# EAGLE design Spectrometer (EAGLE 9.6.2)
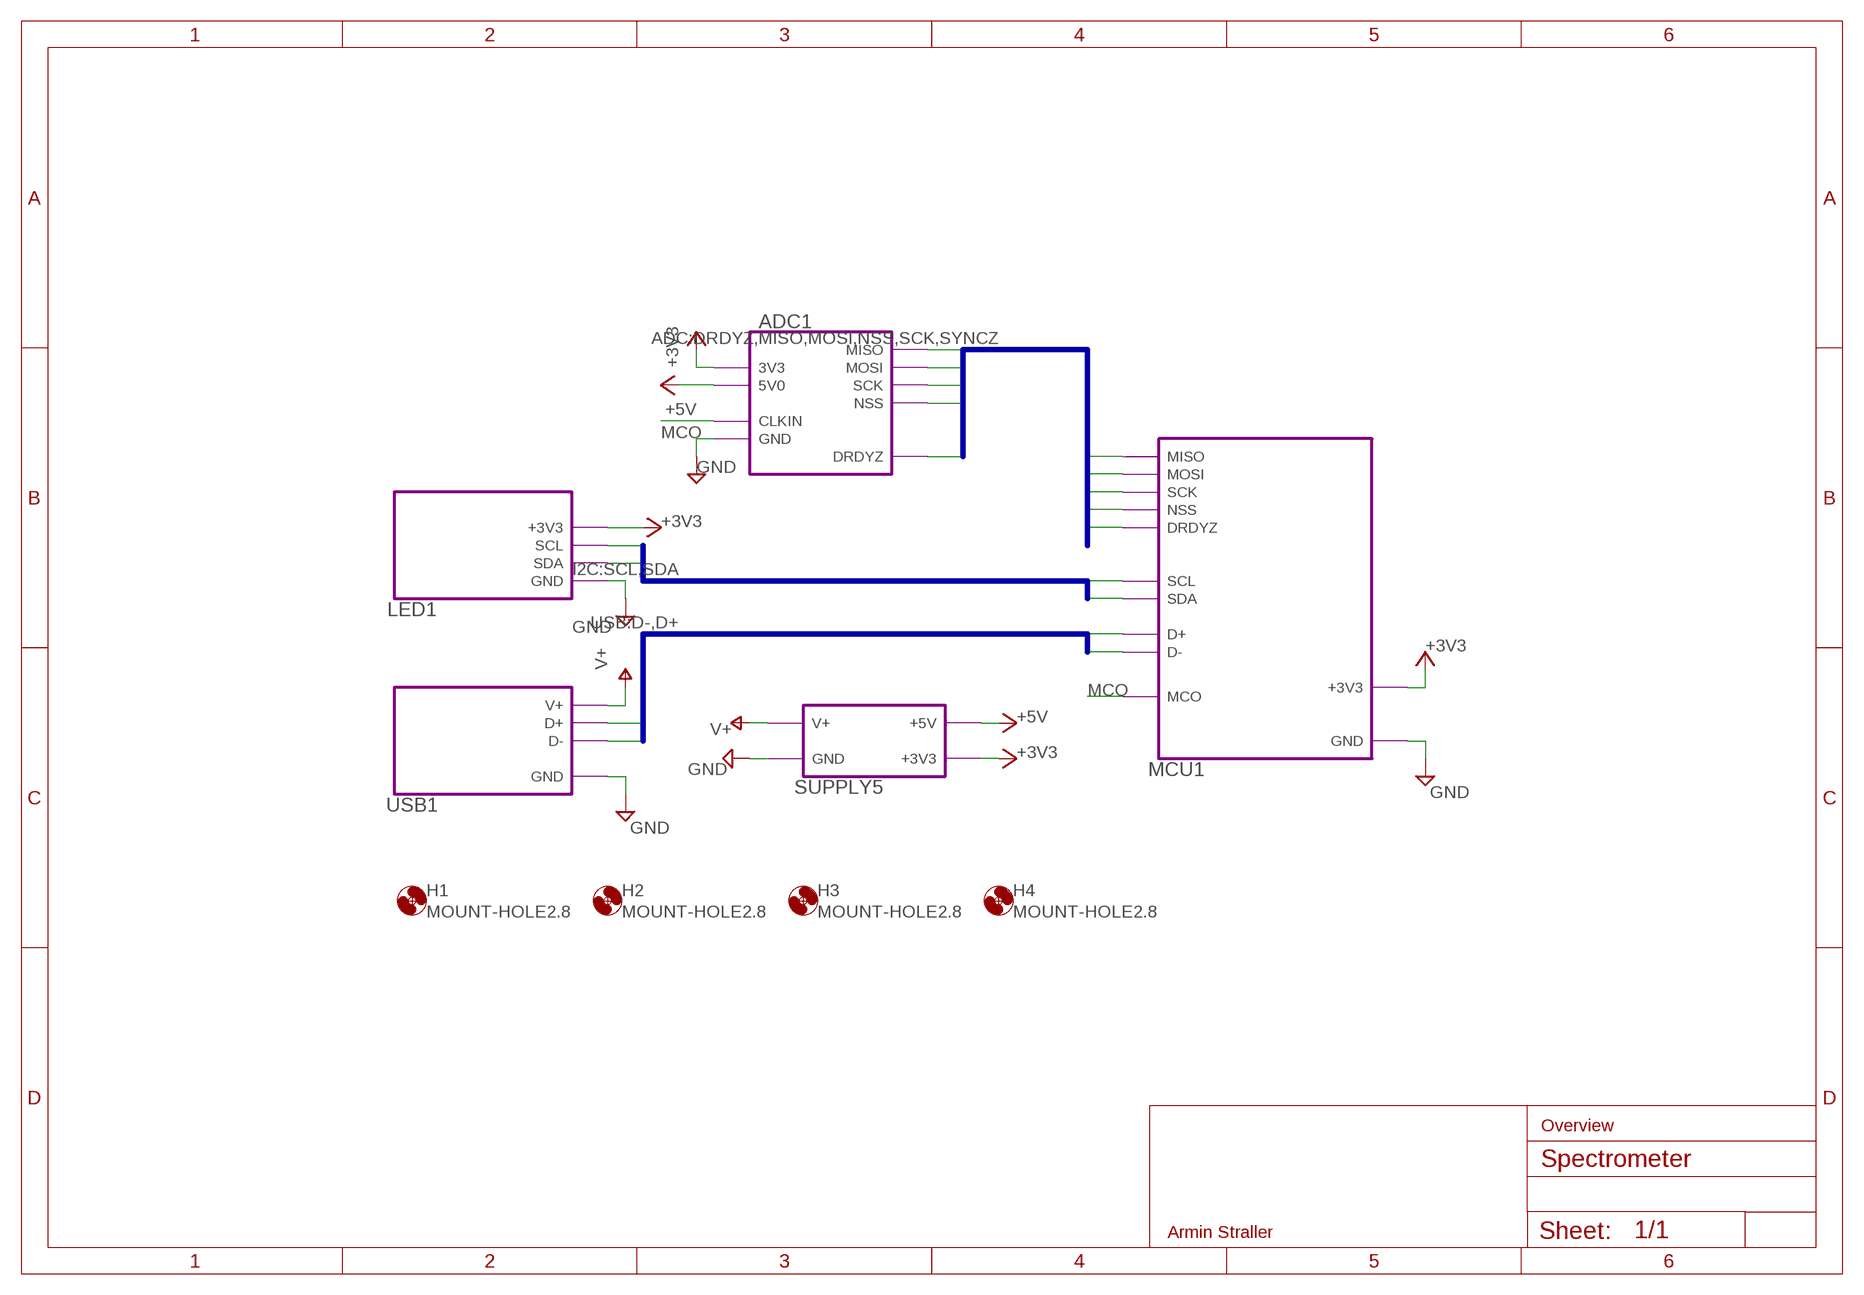
[diagram p0: schematic, sheet 1]

## Parts
H1  MOUNT-HOLE2.8  [2,8]
H2  MOUNT-HOLE2.8  [2,8]
H3  MOUNT-HOLE2.8  [2,8]
H4  MOUNT-HOLE2.8  [2,8]

## Module instances
USB1 = USB_CONNECTOR (part numbers offset by 400)
MCU1 = MICROCONTROLLER (part numbers offset by 300)
ADC1 = ANALOG_FRONTEND (part numbers offset by 200)
LED1 = LED_DRIVER (part numbers offset by 100)
SUPPLY5 = POWER_SUPPLY (part numbers offset by 500)

## Nets
+3V3: port ADC1.3V3 MCU1.+3V3 LED1.+3V3 SUPPLY5.+3V3
+5V: port ADC1.5V0 SUPPLY5.+5V
D+: port USB1.D+ MCU1.D+
D-: port USB1.D- MCU1.D-
DRDYZ: port ADC1.DRDYZ MCU1.DRDYZ
GND: port ADC1.GND USB1.GND MCU1.GND LED1.GND SUPPLY5.GND
MCO: port MCU1.MCO ADC1.CLKIN
MISO: port ADC1.MISO MCU1.MISO
MOSI: port ADC1.MOSI MCU1.MOSI
NSS: port ADC1.NSS MCU1.NSS
SCK: port ADC1.SCK MCU1.SCK
SCL: port MCU1.SCL LED1.SCL
SDA: port MCU1.SDA LED1.SDA
V+: port SUPPLY5.V+ USB1.V+

## Buses
ADC:DRDYZ,MISO,MOSI,NSS,SCK,SYNCZ
I2C:SCL,SDA
USB:D-,D+

## Notes on the sheet
- Overview
- Armin Straller

## Library data of the parts
H1-H4 = holes:MOUNT-HOLE: MOUNTING HOLE with drill center marker

## Module ANALOG_FRONTEND
Ports: 3V3(io) 5V0(io) GND(io) MISO(io) MOSI(io) SCK(io) NSS(io) DRDYZ(io) CLKIN(io)
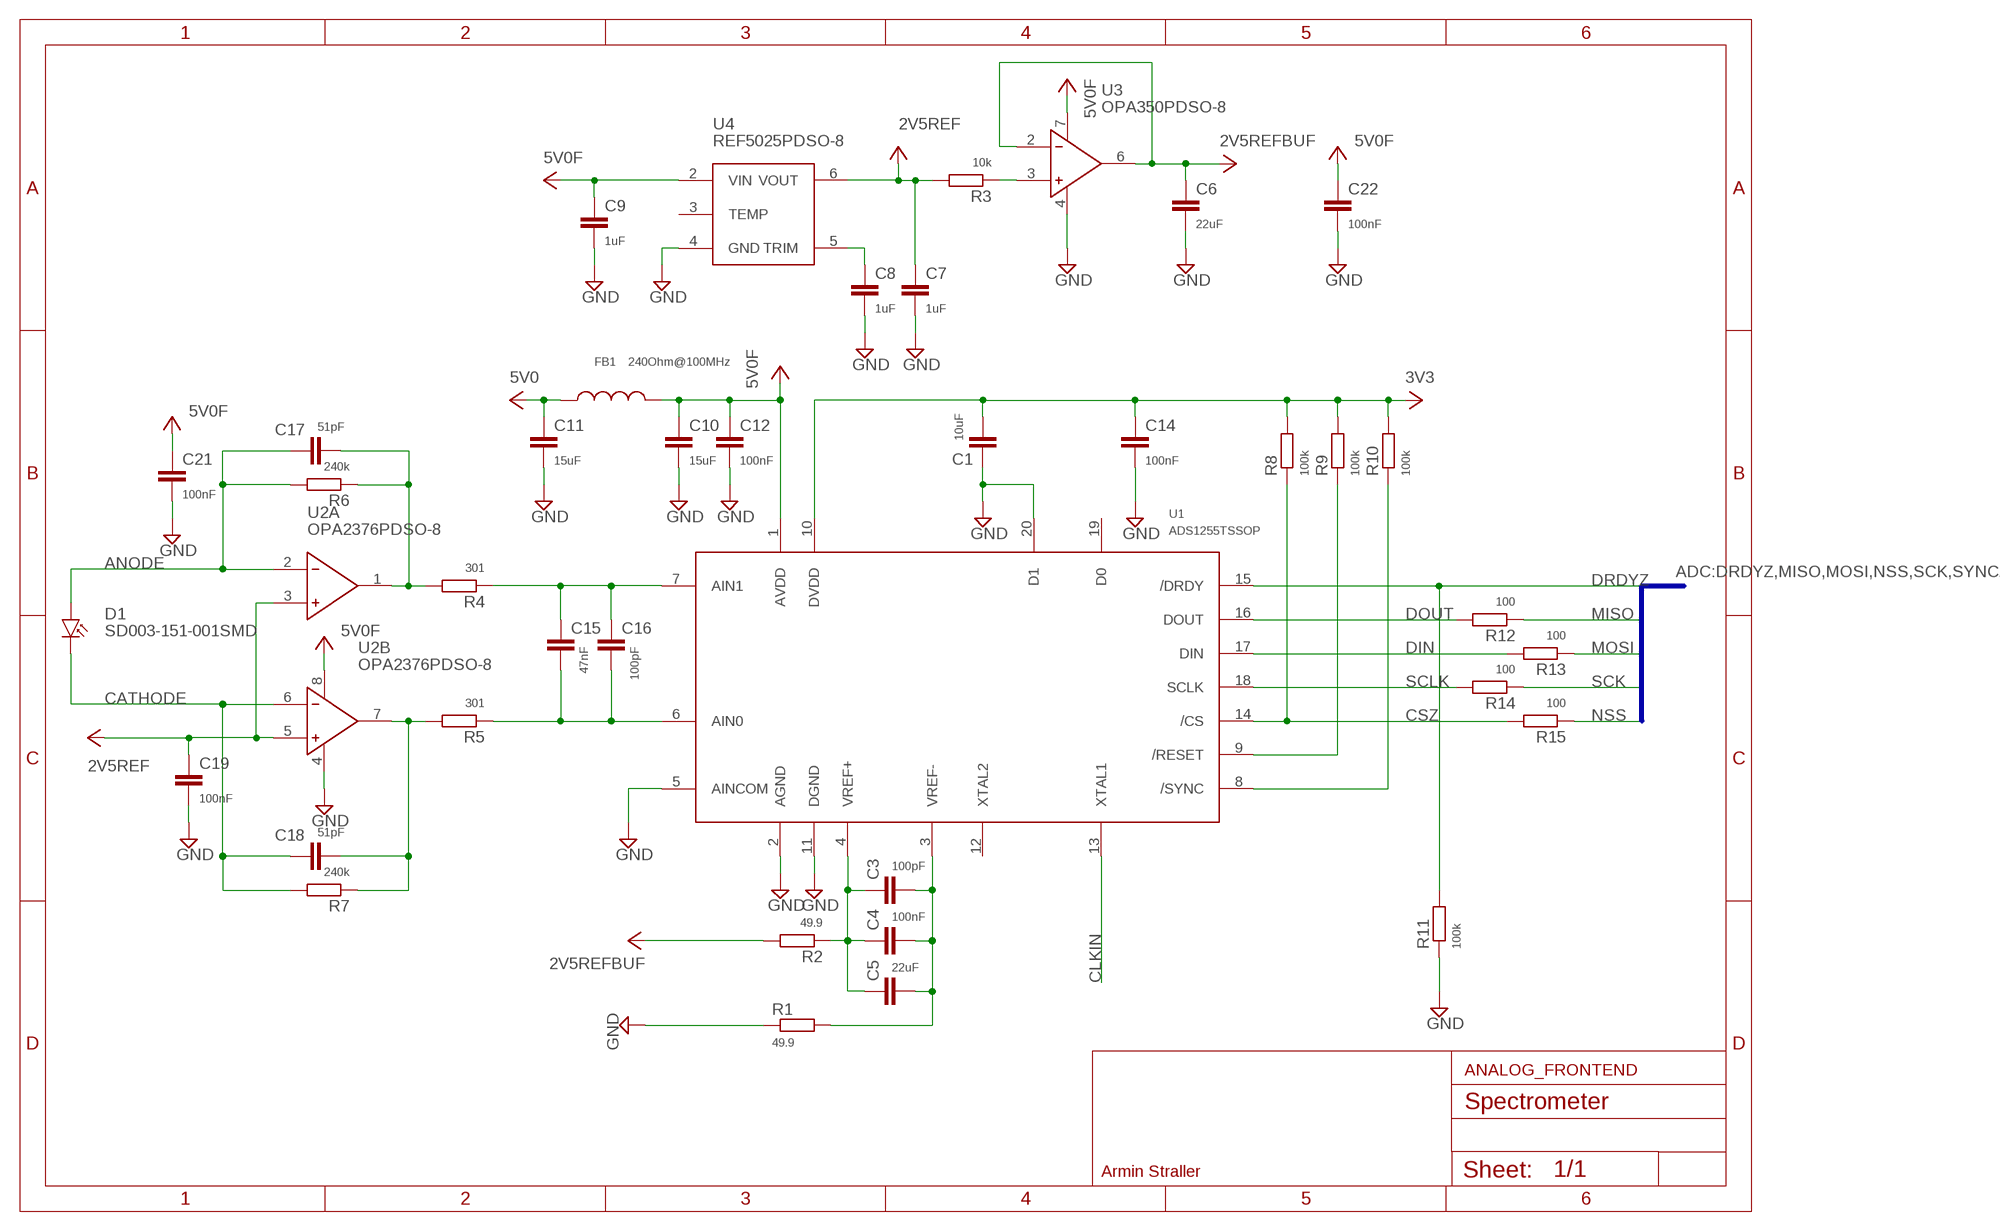
[diagram p1: schematic, module ANALOG_FRONTEND, sheet 1]

### Parts
C1  10uF  C-EUC0805  [C0805]
C3  100pF  C-EUC0402K  [C0402K]
C4  100nF  C-EUC0402K  [C0402K]
C5  22uF  C-EUC0805  [C0805]
C6  22uF  C-EUC0805  [C0805]
C7  1uF  C-EUC0402K  [C0402K]
C8  1uF  C-EUC0402K  [C0402K]
C9  1uF  C-EUC0402K  [C0402K]
C10  15uF  C-EUC0603K  [C0603K]
C11  15uF  C-EUC0603K  [C0603K]
C12  100nF  C-EUC0402K  [C0402K]
C14  100nF  C-EUC0402K  [C0402K]
C15  47nF  C-EUC0402K  [C0402K]
C16  100pF  C-EUC0402K  [C0402K]
C17  51pF  C-EUC0402K  [C0402K]
C18  51pF  C-EUC0402K  [C0402K]
C19  100nF  C-EUC0402K  [C0402K]
C21  100nF  C-EUC0402K  [C0402K]
C22  100nF  C-EUC0402K  [C0402K]
D1  SD003-151-001SMD  [LEDC3316X110]
FB1  240Ohm@100MHz  WE-CBF_0603_742792631_WB_HS  [WE-CBF_0603(W=2.2)]
R1  49.9  R-EU_R0402  [R0402]
R2  49.9  R-EU_R0402  [R0402]
R3  10k  R-EU_R0402  [R0402]
R4  301  R-EU_R0402  [R0402]
R5  301  R-EU_R0402  [R0402]
R6  240k  R-EU_R0402  [R0402]
R7  240k  R-EU_R0402  [R0402]
R8  100k  R-EU_R0402  [R0402]
R9  100k  R-EU_R0402  [R0402]
R10  100k  R-EU_R0402  [R0402]
R11  100k  R-EU_R0402  [R0402]
R12  100  R-EU_R0402  [R0402]
R13  100  R-EU_R0402  [R0402]
R14  100  R-EU_R0402  [R0402]
R15  100  R-EU_R0402  [R0402]
U1  ADS1255TSSOP  [SOP65P780X200-20]
U2  OPA2376PDSO-8  [SOP65P490X110-8]
U3  OPA350PDSO-8  [SOP65P490X110-8]
U4  REF5025PDSO-8  [SOP65P490X110-8]

### Nets
2V5REF: C7.1 C19.1 R3.2 U2.3(A:IN2) U2.5(B:IN2) U4.6(VOUT)
2V5REFBUF: C6.2 R2.2 U3.2(IN1) U3.6(OUT1)
3V3: C1.2 C14.1 R8.2 R9.2 R10.2 U1.10(DVDD)
5V0: C11.2 FB1.1
5V0F: C9.1 C10.2 C12.1 C21.1 C22.1 FB1.2 U1.1(AVDD) U2.8(B:VDD) U3.7(VDD) U4.2(VIN)
ANODE: C17.1 D1.2(ANODE) R6.2 U2.2(A:IN1)
CATHODE: C18.1 D1.1(CATHODE) R7.2 U2.6(B:IN1)
CLKIN: U1.13(XTAL1)
CSZ: R8.1 R15.2 U1.14(/CS)
DIN: R13.2 U1.17(DIN)
DOUT: R12.2 U1.16(DOUT)
DRDYZ: R11.2 U1.15(/DRDY)
GND: C1.1 C6.1 C7.2 C8.2 C9.2 C10.1 C11.1 C12.2 C14.2 C19.2 C21.2 C22.2 R1.1 R11.1 U1.2(AGND) U1.5(AINCOM) U1.11(DGND) U1.20(D1) U2.4(B:GND) U3.4(GND) U4.4(GND)
MISO: R12.1
MOSI: R13.1
N$3: C3.2 C4.2 C5.2 R1.2 U1.3(VREF-)
N$4: C3.1 C4.1 C5.1 R2.1 U1.4(VREF+)
N$5: R3.1 U3.3(IN2)
N$6: C8.1 U4.5(TRIM)
N$7: C17.2 R4.2 R6.1 U2.1(A:OUT1)
N$8: C18.2 R5.2 R7.1 U2.7(B:OUT1)
N$9: C15.2 C16.2 R5.1 U1.6(AIN0)
N$10: C15.1 C16.1 R4.1 U1.7(AIN1)
N$11: R9.1 U1.9(/RESET)
NSS: R15.1
SCK: R14.1
SCLK: R14.2 U1.18(SCLK)
SYNCZ: R10.1 U1.8(/SYNC)
Unconnected: U1.12(XTAL2) U1.19(D0) U4.3(TEMP)

### Buses
ADC:DRDYZ,MISO,MOSI,NSS,SCK,SYNCZ

### Notes on the sheet
- Armin Straller

### Library data of the parts
C1 C3-C12 C14-C19 C21 C22 = rcl:C-EU: CAPACITOR, European symbol; SPICEPREFIX: C
D1 = spectrometer:SD003-151-001: Surface-Mount InGaAs Photodetector
FB1 = Wurth_EMC Components_WE-CBF:WE-CBF_0603: WE-CBF SMD EMI Suppression Ferrite Bead Characteristics Reliable Ni-Sn electrodes High rated current up to 6 A Operating temperature: –55 ºC to +125 ºC Applications Perfect as data lined filter and for uncoupling of distribution voltage Package name and Variant abbreviation: Package: Wide Band /High Speed: W=Width= 2.2 High Current: W=Width= 2.6 Variant abbreviation: WB = Wide Band HS=High Speed HC=High Current <https://katalog.we-online.de/media/images/v2/o14753v209%20Family_WE-CBF.jpg> Details see: http://katalog.we-online.de/en/pbs/WE-CBF Updated by Ella Wu 2019-01-02 2019 (C) Wurth Elektronik; DATASHEET-URL: https://www.we-online.com/catalog/datasheet/742792631.pdf; IR1: 200mA; IR2: 1800mA; MOUNT: SMT; PART-NUMBER: 742792631; RDC-MAX: 0.4Ohm; TYPE: Wide Band; Z: 235Ohm@1GMHz; ZMAX: 340Ohm
R1-R15 = rcl:R-EU_: RESISTOR, European symbol; SPICEPREFIX: R
U1 = spectrometer:ADS1255
U2 = spectrometer:OPA2376
U3 = spectrometer:OPA350
U4 = spectrometer:REF5025

## Module USB_CONNECTOR
Ports: GND(io) D+(io) D-(io) V+(io)
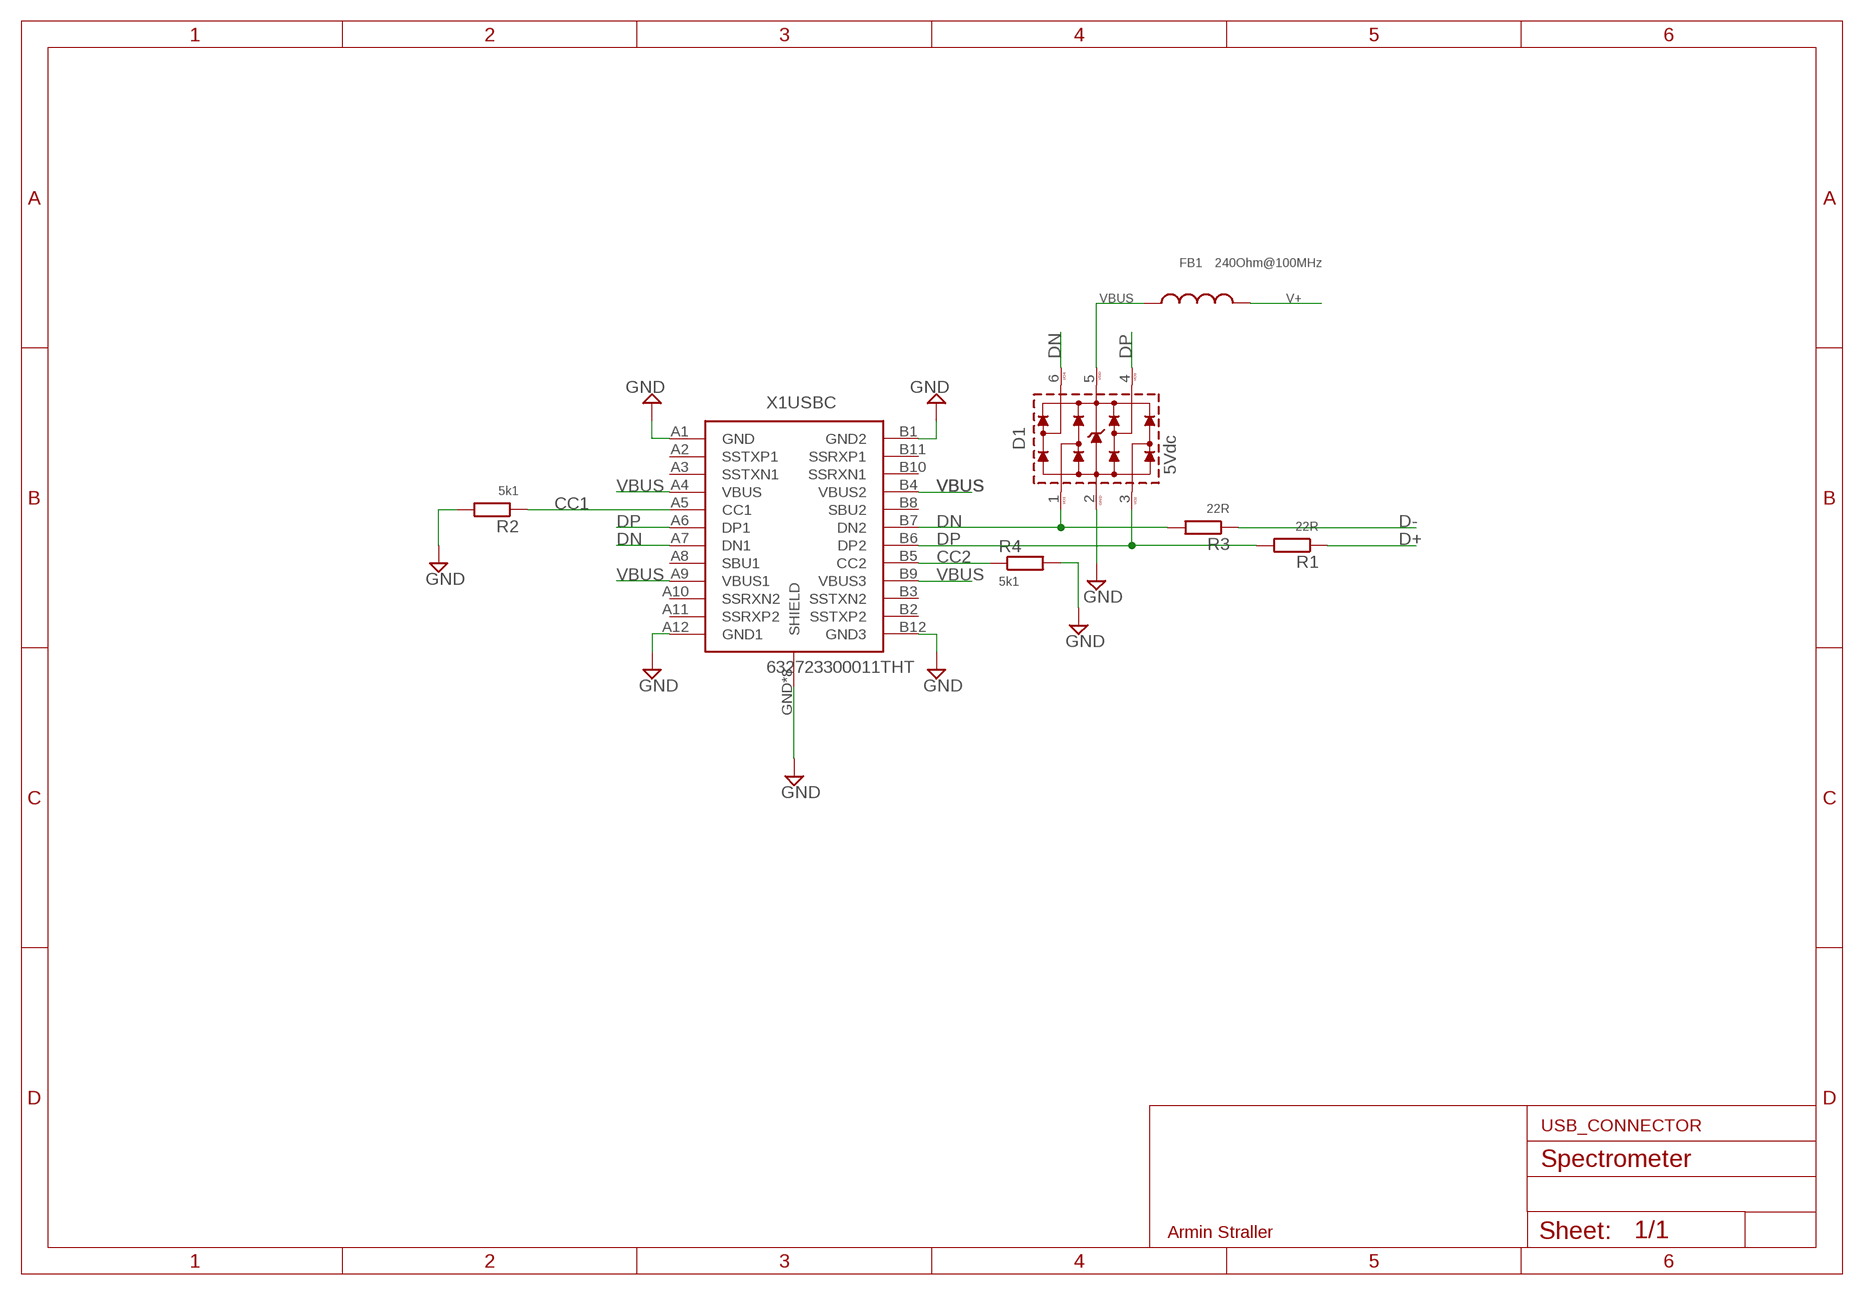
[diagram p2: schematic, module USB_CONNECTOR, sheet 1]

### Parts
D1  5Vdc  WE-TVS-HS_SOT23-6L_824001  [WE-TVS_SOT23-6L]
FB1  240Ohm@100MHz  WE-CBF_0603_742792631_WB_HS  [WE-CBF_0603(W=2.2)]
R1  22R  R-EU_R0402  [R0402]
R2  5k1  R-EU_R0402  [R0402]
R3  22R  R-EU_R0402  [R0402]
R4  5k1  R-EU_R0402  [R0402]
X1  632723300011THT  [USBC_HORZONTAL_WE]

### Nets
CC1: R2.1 X1.A5(USBC:CC1)
CC2: R4.1 X1.B5(USBC:CC2)
D+: R1.1
D-: R3.1
DN: D1.1 D1.6 R3.2 X1.A7(USBC:DN1) X1.B7(USBC:DN2)
DP: D1.3 D1.4 R1.2 X1.A6(USBC:DP1) X1.B6(USBC:DP2)
GND: D1.2(GND) R2.2 R4.2 X1.A1(USBC:GND) X1.A12(USBC:GND1) X1.B1(USBC:GND2) X1.B12(USBC:GND3) X1.GND1(SHIELD) X1.GND(SHIELD) X1.Z1(SHIELD) X1.Z2(SHIELD) X1.Z3(SHIELD) X1.Z4(SHIELD) X1.Z5(SHIELD) X1.Z6(SHIELD)
V+: FB1.2
VBUS: D1.5(VDD) FB1.1 X1.A4(USBC:VBUS) X1.A9(USBC:VBUS1) X1.B4(USBC:VBUS2) X1.B9(USBC:VBUS3)
Unconnected: X1.A2(USBC:SSTXP1) X1.A3(USBC:SSTXN1) X1.A8(USBC:SBU1) X1.A10(USBC:SSRXN2) X1.A11(USBC:SSRXP2) X1.B2(USBC:SSTXP2) X1.B3(USBC:SSTXN2) X1.B8(USBC:SBU2) X1.B10(USBC:SSRXN1) X1.B11(USBC:SSRXP1)

### Notes on the sheet
- Armin Straller

### Library data of the parts
D1 = Wurth_EMC Components_WE-TVS:WE-TVS-HS_SOT23-6L_824001: WE-TVS TVS Diode – High Speed Series Characteristics Low clamping voltage Sturdy design Very low capacitance Flow Thru Design for a simple layout Rail to Rail protection Epoxy flame resistant UL94-V0 RoHS, REACH and free of halogens Applications Very fast data lines USB 2.0 Ethernet PoE VGA Sim Cards Keypads HS = High Speed <https://katalog.we-online.com/media/images/v2/o14883v209%20Family_WE-TVS_HIGHSPEED.> Details see: https://katalog.we-online.com/en/pbs/WE-TVS-HS Updated by Ella Wu 2019-07-12 2019 (C) Wurth Elektronik; C-CH: 1pF; CHANNELS: 4+1; DATASHEET-URL: https://www.we-online.com/catalog/datasheet/824001.pdf; IPEAK: 5A; MOUNT: SMT; PART-NUMBER: 824001; VBR: 6.2V
FB1 = Wurth_EMC Components_WE-CBF:WE-CBF_0603: WE-CBF SMD EMI Suppression Ferrite Bead Characteristics Reliable Ni-Sn electrodes High rated current up to 6 A Operating temperature: –55 ºC to +125 ºC Applications Perfect as data lined filter and for uncoupling of distribution voltage Package name and Variant abbreviation: Package: Wide Band /High Speed: W=Width= 2.2 High Current: W=Width= 2.6 Variant abbreviation: WB = Wide Band HS=High Speed HC=High Current <https://katalog.we-online.de/media/images/v2/o14753v209%20Family_WE-CBF.jpg> Details see: http://katalog.we-online.de/en/pbs/WE-CBF Updated by Ella Wu 2019-01-02 2019 (C) Wurth Elektronik; DATASHEET-URL: https://www.we-online.com/catalog/datasheet/742792631.pdf; IR1: 200mA; IR2: 1800mA; MOUNT: SMT; PART-NUMBER: 742792631; RDC-MAX: 0.4Ohm; TYPE: Wide Band; Z: 235Ohm@1GMHz; ZMAX: 340Ohm
R1-R4 = rcl:R-EU_: RESISTOR, European symbol; SPICEPREFIX: R
X1 = spectrometer:632723300011

## Module MICROCONTROLLER
Ports: MISO(io) MOSI(io) SCK(io) NSS(io) DRDYZ(io) SCL(io) SDA(io) D+(io) D-(io) GND(io) +3V3(io) MCO(io)
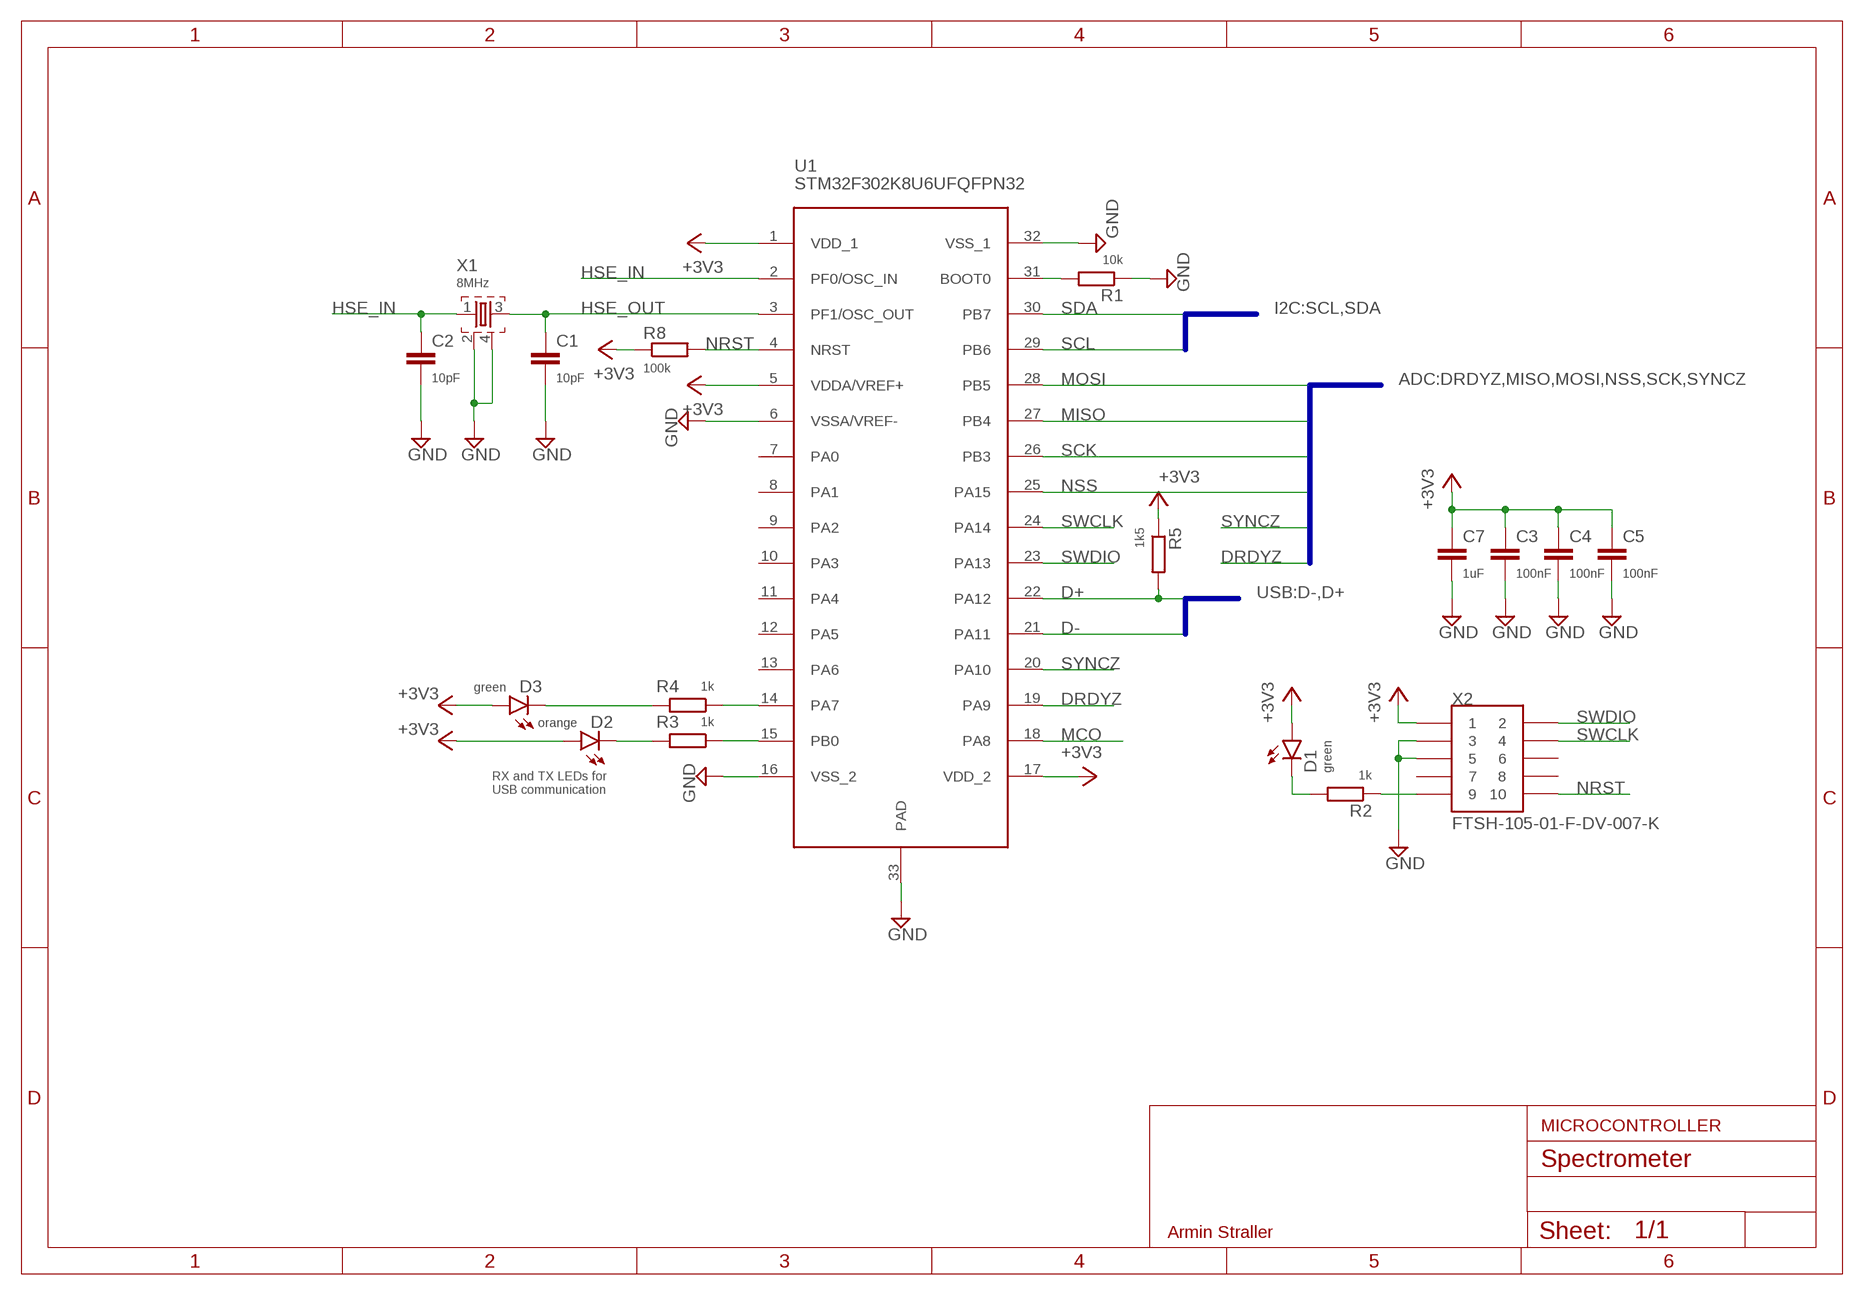
[diagram p3: schematic, module MICROCONTROLLER, sheet 1]

### Parts
C1  10pF  C-EUC0402K  [C0402K]
C2  10pF  C-EUC0402K  [C0402K]
C3  100nF  C-EUC0402K  [C0402K]
C4  100nF  C-EUC0402K  [C0402K]
C5  100nF  C-EUC0402K  [C0402K]
C7  1uF  C-EUC0402K  [C0402K]
D1  green  LEDCHIP-LED0603  [CHIP-LED0603]
D2  orange  LEDCHIP-LED0603  [CHIP-LED0603]
D3  green  LEDCHIP-LED0603  [CHIP-LED0603]
R1  10k  R-EU_R0402  [R0402]
R2  1k  R-EU_R0402  [R0402]
R3  1k  R-EU_R0402  [R0402]
R4  1k  R-EU_R0402  [R0402]
R5  1k5  R-EU_R0402  [R0402]
R8  100k  R-EU_R0402  [R0402]
U1  STM32F302K8U6UFQFPN32  [QFN50P500X500X60-33T350]
X1  8MHz  CRYSTALS-GND-LID-CFPX-218  [2.6X2.1-4-PAD]
X2  CORTEX-MDEBUG-10P  [CORTEX-M-CON-10P]

### Nets
+3V3: C3.1 C4.1 C5.1 C7.1 D1.A D2.A D3.A R5.1 R8.1 U1.1(VDD_1) U1.5(VDDA/VREF+) U1.17(VDD_2) X2.P$1
D+: R5.2 U1.22(PA12)
D-: U1.21(PA11)
DRDYZ: U1.19(PA9)
GND: C1.2 C2.2 C3.2 C4.2 C5.2 C7.2 R1.1 U1.6(VSSA/VREF-) U1.16(VSS_2) U1.32(VSS_1) U1.33(PAD) X1.2 X1.4 X2.P$3 X2.P$5
HSE_IN: C2.1 U1.2(PF0/OSC_IN) X1.1
HSE_OUT: C1.1 U1.3(PF1/OSC_OUT) X1.3
MCO: U1.18(PA8)
MISO: U1.27(PB4)
MOSI: U1.28(PB5)
N$1: R4.1 U1.14(PA7)
N$2: R1.2 U1.31(BOOT0)
N$3: R2.1 X2.P$9
N$4: D1.C R2.2
N$5: R3.1 U1.15(PB0)
N$6: D3.C R4.2
N$7: D2.C R3.2
NRST: R8.2 U1.4(NRST) X2.P$10
NSS: U1.25(PA15)
SCK: U1.26(PB3)
SCL: U1.29(PB6)
SDA: U1.30(PB7)
SWCLK: U1.24(PA14) X2.P$4
SWDIO: U1.23(PA13) X2.P$2
SYNCZ: U1.20(PA10)
Unconnected: U1.7(PA0) U1.8(PA1) U1.9(PA2) U1.10(PA3) U1.11(PA4) U1.12(PA5) U1.13(PA6) X2.P$6 X2.P$7 X2.P$8

### Buses
I2C:SCL,SDA
ADC:DRDYZ,MISO,MOSI,NSS,SCK,SYNCZ
USB:D-,D+

### Notes on the sheet
- RX and TX LEDs for 
  USB communication
- Armin Straller

### Library data of the parts
C1-C5 C7 = rcl:C-EU: CAPACITOR, European symbol; SPICEPREFIX: C
D1-D3 = led:LED: LED OSRAM: - CHIPLED LG R971, LG N971, LY N971, LG Q971, LY Q971, LO R971, LY R971 LH N974, LH R974 LS Q976, LO Q976, LY Q976 LO Q996 - Hyper CHIPLED LW Q18S LB Q993, LB Q99A, LB R99A - SideLED LS A670, LO A670, LY A670, LG A670, LP A670 LB A673, LV A673, LT A673, LW A673 LH A674 LY A675 LS A676, LA A676, LO A676, LY A676, LW A676 LS A679, LY A679, LG A679 - Hyper Micro SIDELED® LS Y876, LA Y876, LO Y876, LY Y876 LT Y87S - SmartLED LW L88C, LW L88S LB L89C, LB L89S, LG L890 LS L89K, LO L89K, LY L89K LS L896, LA L896, LO L896, LY L896 - TOPLED LS T670, LO T670, LY T670, LG T670, LP T670 LSG T670, LSP T670, LSY T670, LOP T670, LYG T670 LG T671, LOG T671, LSG T671 LB T673, LV T673, LT T673, LW T673 LH T674 LS T676, LA T676, LO T676, LY T676, LB T676, LH T676, LSB T676, LW T676 LB T67C, LV T67C, LT T67C, LS T67K, LO T67K, LY T67K, LW E67C LS E67B, LA E67B, LO E67B, LY E67B, LB E67C, LV E67C, LT E67C LW T67C LS T679, LY T679, LG T679 LS T770, LO T770, LY T770, LG T770, LP T770 LB T773, LV T773, LT T773, LW T773 LH T774 LS E675, LA E675, LY E675, LS T675 LS T776, LA T776, LO T776, LY T776, LB T776 LHGB T686 LT T68C, LB T68C - Hyper Mini TOPLED® LB M676 - Mini TOPLED Santana® LG M470 LS M47K, LO M47K, LY M47K Source: http://www.osram.convergy.de LUXEON: - LUMILED® LXK2-PW12-R00, LXK2-PW12-S00, LXK2-PW14-U00, LXK2-PW14-V00 LXK2-PM12-R00, LXK2-PM12-S00, LXK2-PM14-U00 LXK2-PE12-Q00, LXK2-PE12-R00, LXK2-PE12-S00, LXK2-PE14-T00, LXK2-PE14-U00 LXK2-PB12-K00, LXK2-PB12-L00, LXK2-PB12-M00, LXK2-PB14-N00, LXK2-PB14-P00, LXK2-PB14-Q00 LXK2-PR12-L00, LXK2-PR12-M00, LXK2-PR14-Q00, LXK2-PR14-R00 LXK2-PD12-Q00, LXK2-PD12-R00, LXK2-PD12-S00 LXK2-PH12-R00, LXK2-PH12-S00 LXK2-PL12-P00, LXK2-PL12-Q00, LXK2-PL12-R00 Source: www.luxeon.com KINGBRIGHT: KA-3528ASYC Source: www.kingbright.com
R1-R5 R8 = rcl:R-EU_: RESISTOR, European symbol; SPICEPREFIX: R
U1 = spectrometer:STM32F302K8U6
X1 = IQD-Frequency-Products:CRYSTALS-GND-LID: CRYSTALS WITH CAN GROUNDED
X2 = spectrometer:CORTEX-MDEBUG-10P

## Module LED_DRIVER
Ports: GND(io) +3V3(io) SCL(io) SDA(io)
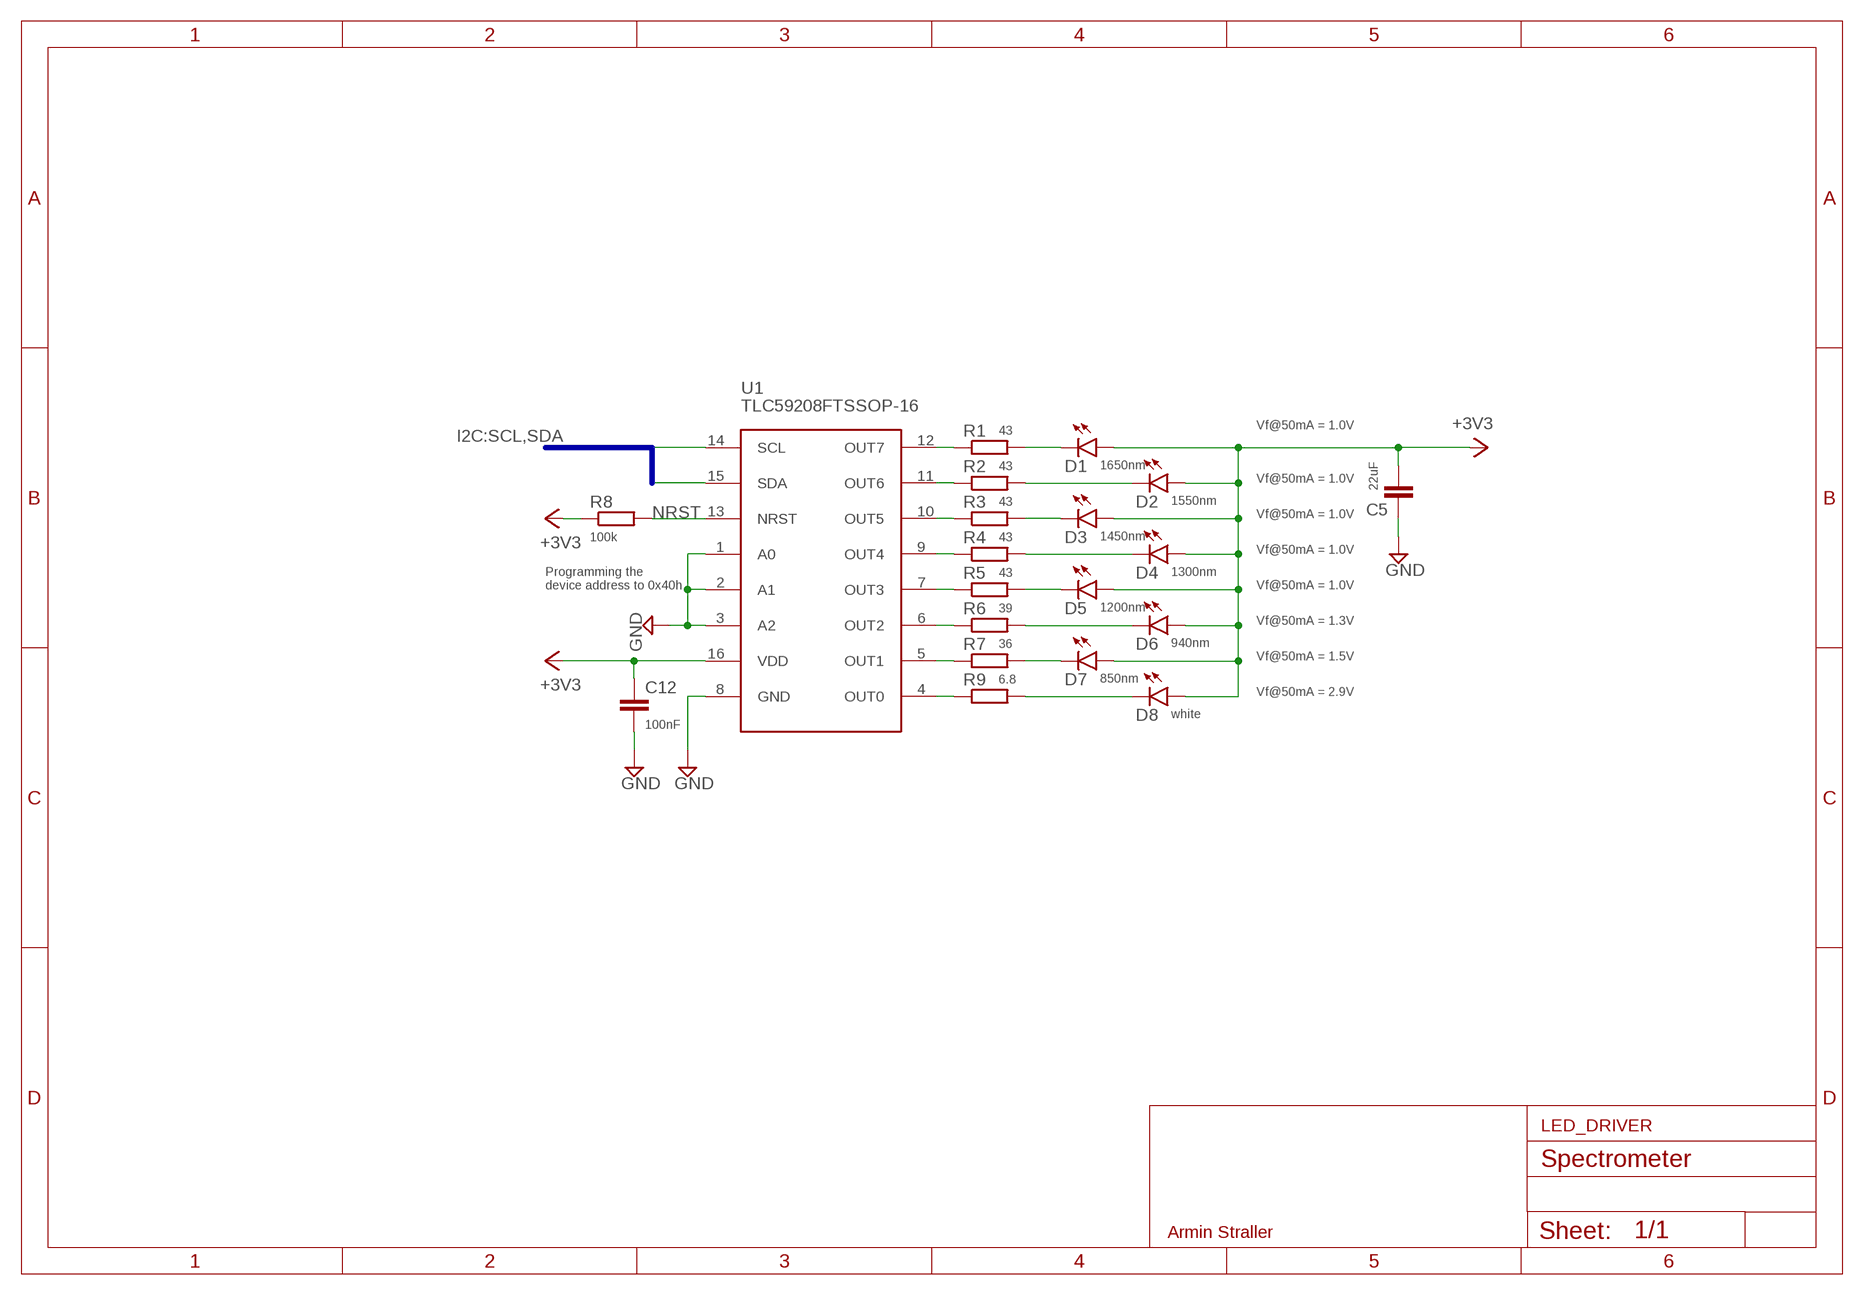
[diagram p4: schematic, module LED_DRIVER, sheet 1]

### Parts
C5  22uF  C-EUC0805  [C0805]
C12  100nF  C-EUC0402K  [C0402K]
D1  1650nm  LEDCHIPLED_1206  [CHIPLED_1206]
D2  1550nm  LEDCHIPLED_1206  [CHIPLED_1206]
D3  1450nm  LEDCHIPLED_1206  [CHIPLED_1206]
D4  1300nm  LEDCHIPLED_1206  [CHIPLED_1206]
D5  1200nm  LEDCHIPLED_1206  [CHIPLED_1206]
D6  940nm  LEDCHIPLED_1206  [CHIPLED_1206]
D7  850nm  LEDCHIPLED_1206  [CHIPLED_1206]
D8  white  LEDCHIPLED_1206  [CHIPLED_1206]
R1  43  R-EU_R0603  [R0603]
R2  43  R-EU_R0603  [R0603]
R3  43  R-EU_R0603  [R0603]
R4  43  R-EU_R0603  [R0603]
R5  43  R-EU_R0603  [R0603]
R6  39  R-EU_R0603  [R0603]
R7  36  R-EU_R0603  [R0603]
R8  100k  R-EU_R0402  [R0402]
R9  6.8  R-EU_R0603  [R0603]
U1  TLC59208FTSSOP-16  [SOP65P640X120-16]

### Nets
+3V3: C5.2 C12.1 D1.A D2.A D3.A D4.A D5.A D6.A D7.A D8.A R8.1 U1.16(VDD)
GND: C5.1 C12.2 U1.1(A0) U1.2(A1) U1.3(A2) U1.8(GND)
N$1: R1.1 U1.12(OUT7)
N$2: R2.1 U1.11(OUT6)
N$3: R3.1 U1.10(OUT5)
N$4: R4.1 U1.9(OUT4)
N$5: R5.1 U1.7(OUT3)
N$6: R6.1 U1.6(OUT2)
N$7: R7.1 U1.5(OUT1)
N$8: R9.1 U1.4(OUT0)
N$9: D8.C R9.2
N$10: D7.C R7.2
N$11: D6.C R6.2
N$12: D5.C R5.2
N$13: D4.C R4.2
N$14: D3.C R3.2
N$15: D2.C R2.2
N$16: D1.C R1.2
NRST: R8.2 U1.13(NRST)
SCL: U1.14(SCL)
SDA: U1.15(SDA)

### Buses
I2C:SCL,SDA

### Notes on the sheet
- Vf@50mA = 1.0V
- Vf@50mA = 1.0V
- Vf@50mA = 1.0V
- Vf@50mA = 1.0V
- Programming the 
  device address to 0x40h
- Vf@50mA = 1.0V
- Vf@50mA = 1.3V
- Vf@50mA = 1.5V
- Vf@50mA = 2.9V
- Armin Straller

### Library data of the parts
C5 C12 = rcl:C-EU: CAPACITOR, European symbol; SPICEPREFIX: C
D1-D8 = led:LED: LED OSRAM: - CHIPLED LG R971, LG N971, LY N971, LG Q971, LY Q971, LO R971, LY R971 LH N974, LH R974 LS Q976, LO Q976, LY Q976 LO Q996 - Hyper CHIPLED LW Q18S LB Q993, LB Q99A, LB R99A - SideLED LS A670, LO A670, LY A670, LG A670, LP A670 LB A673, LV A673, LT A673, LW A673 LH A674 LY A675 LS A676, LA A676, LO A676, LY A676, LW A676 LS A679, LY A679, LG A679 - Hyper Micro SIDELED® LS Y876, LA Y876, LO Y876, LY Y876 LT Y87S - SmartLED LW L88C, LW L88S LB L89C, LB L89S, LG L890 LS L89K, LO L89K, LY L89K LS L896, LA L896, LO L896, LY L896 - TOPLED LS T670, LO T670, LY T670, LG T670, LP T670 LSG T670, LSP T670, LSY T670, LOP T670, LYG T670 LG T671, LOG T671, LSG T671 LB T673, LV T673, LT T673, LW T673 LH T674 LS T676, LA T676, LO T676, LY T676, LB T676, LH T676, LSB T676, LW T676 LB T67C, LV T67C, LT T67C, LS T67K, LO T67K, LY T67K, LW E67C LS E67B, LA E67B, LO E67B, LY E67B, LB E67C, LV E67C, LT E67C LW T67C LS T679, LY T679, LG T679 LS T770, LO T770, LY T770, LG T770, LP T770 LB T773, LV T773, LT T773, LW T773 LH T774 LS E675, LA E675, LY E675, LS T675 LS T776, LA T776, LO T776, LY T776, LB T776 LHGB T686 LT T68C, LB T68C - Hyper Mini TOPLED® LB M676 - Mini TOPLED Santana® LG M470 LS M47K, LO M47K, LY M47K Source: http://www.osram.convergy.de LUXEON: - LUMILED® LXK2-PW12-R00, LXK2-PW12-S00, LXK2-PW14-U00, LXK2-PW14-V00 LXK2-PM12-R00, LXK2-PM12-S00, LXK2-PM14-U00 LXK2-PE12-Q00, LXK2-PE12-R00, LXK2-PE12-S00, LXK2-PE14-T00, LXK2-PE14-U00 LXK2-PB12-K00, LXK2-PB12-L00, LXK2-PB12-M00, LXK2-PB14-N00, LXK2-PB14-P00, LXK2-PB14-Q00 LXK2-PR12-L00, LXK2-PR12-M00, LXK2-PR14-Q00, LXK2-PR14-R00 LXK2-PD12-Q00, LXK2-PD12-R00, LXK2-PD12-S00 LXK2-PH12-R00, LXK2-PH12-S00 LXK2-PL12-P00, LXK2-PL12-Q00, LXK2-PL12-R00 Source: www.luxeon.com KINGBRIGHT: KA-3528ASYC Source: www.kingbright.com
R1-R9 = rcl:R-EU_: RESISTOR, European symbol; SPICEPREFIX: R
U1 = spectrometer:TLC59208F: TLC59208F 8-Bit Fm+ I2C Bus LED Driver

## Module POWER_SUPPLY
Ports: V+(io) GND(io) +5V(io) +3V3(io)
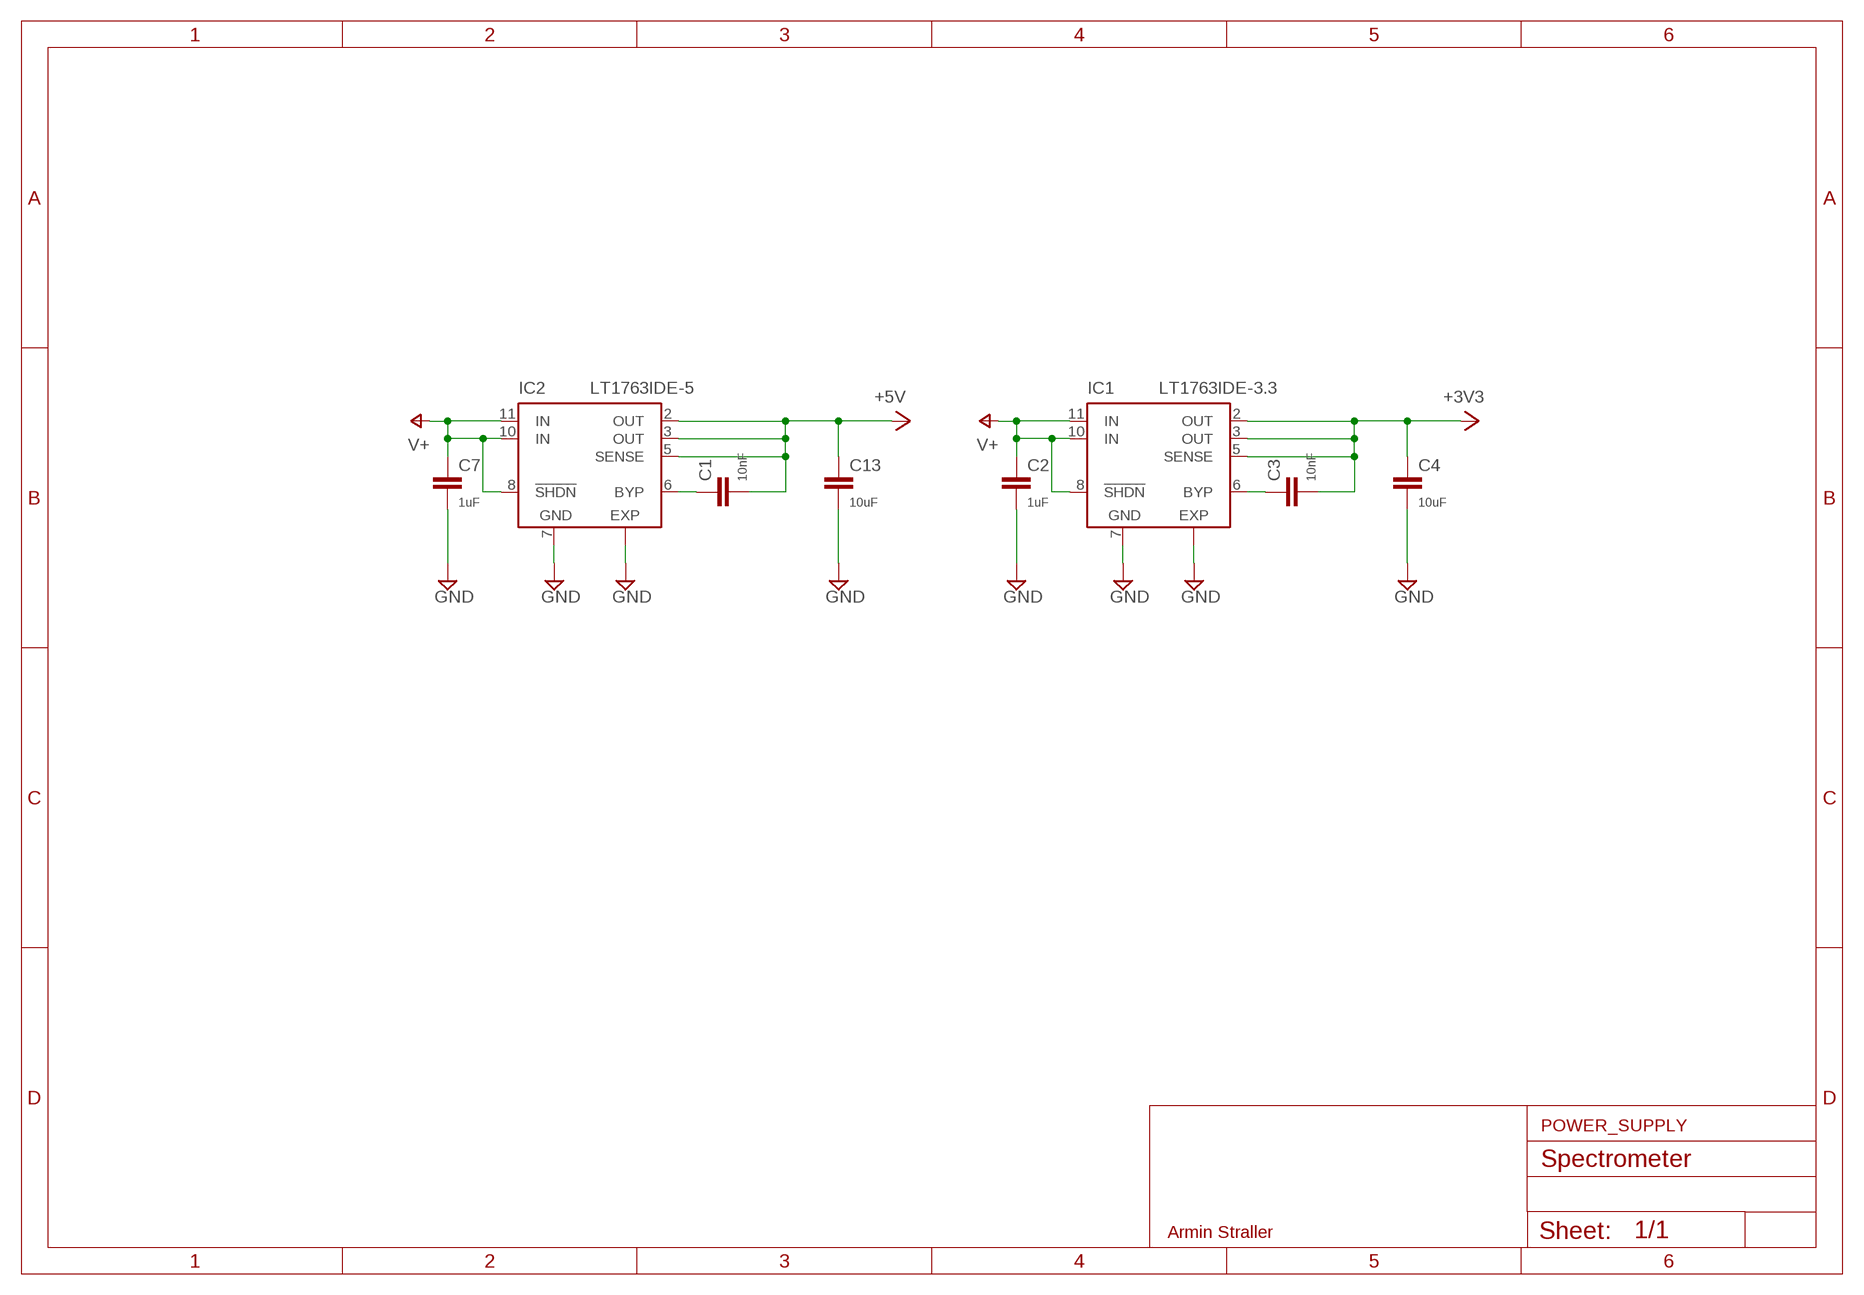
[diagram p5: schematic, module POWER_SUPPLY, sheet 1]

### Parts
C1  10nF  C-EUC0402K  [C0402K]
C2  1uF  C-EUC0402K  [C0402K]
C3  10nF  C-EUC0402K  [C0402K]
C4  10uF  C-EUC0603K  [C0603K]
C7  1uF  C-EUC0402K  [C0402K]
C13  10uF  C-EUC0603K  [C0603K]
IC1  LT1763IDE-3.3  [DFN12]
IC2  LT1763IDE-5  [DFN12]

### Nets
+3V3: C3.2 C4.2 IC1.2(OUT) IC1.3(OUT) IC1.5(SENSE)
+5V: C1.2 C13.2 IC2.2(OUT) IC2.3(OUT) IC2.5(SENSE)
GND: C2.2 C4.1 C7.2 C13.1 IC1.7(GND) IC1.EXP IC2.7(GND) IC2.EXP
N$1: C1.1 IC2.6(BYP)
N$2: C3.1 IC1.6(BYP)
V+: C2.1 C7.1 IC1.8(!SHDN) IC1.10(IN) IC1.11(IN) IC2.8(!SHDN) IC2.10(IN) IC2.11(IN)

### Notes on the sheet
- Armin Straller

### Library data of the parts
C1-C4 C7 C13 = rcl:C-EU: CAPACITOR, European symbol; SPICEPREFIX: C
IC1 = linear-technology:LT1763: 500mA, Low Noise, LDO Micropower Regulators Source: http://cds.linear.com/docs/Datasheet/1763ff.pdf; MPN: LT1763IDE-3.3#PBF; OC_FARNELL: 1783320; OC_NEWARK: 51R1529
IC2 = linear-technology:LT1763: 500mA, Low Noise, LDO Micropower Regulators Source: http://cds.linear.com/docs/Datasheet/1763ff.pdf; MPN: LT1763IDE-5#PBF; OC_FARNELL: 1839222; OC_NEWARK: 51R1531

## Board
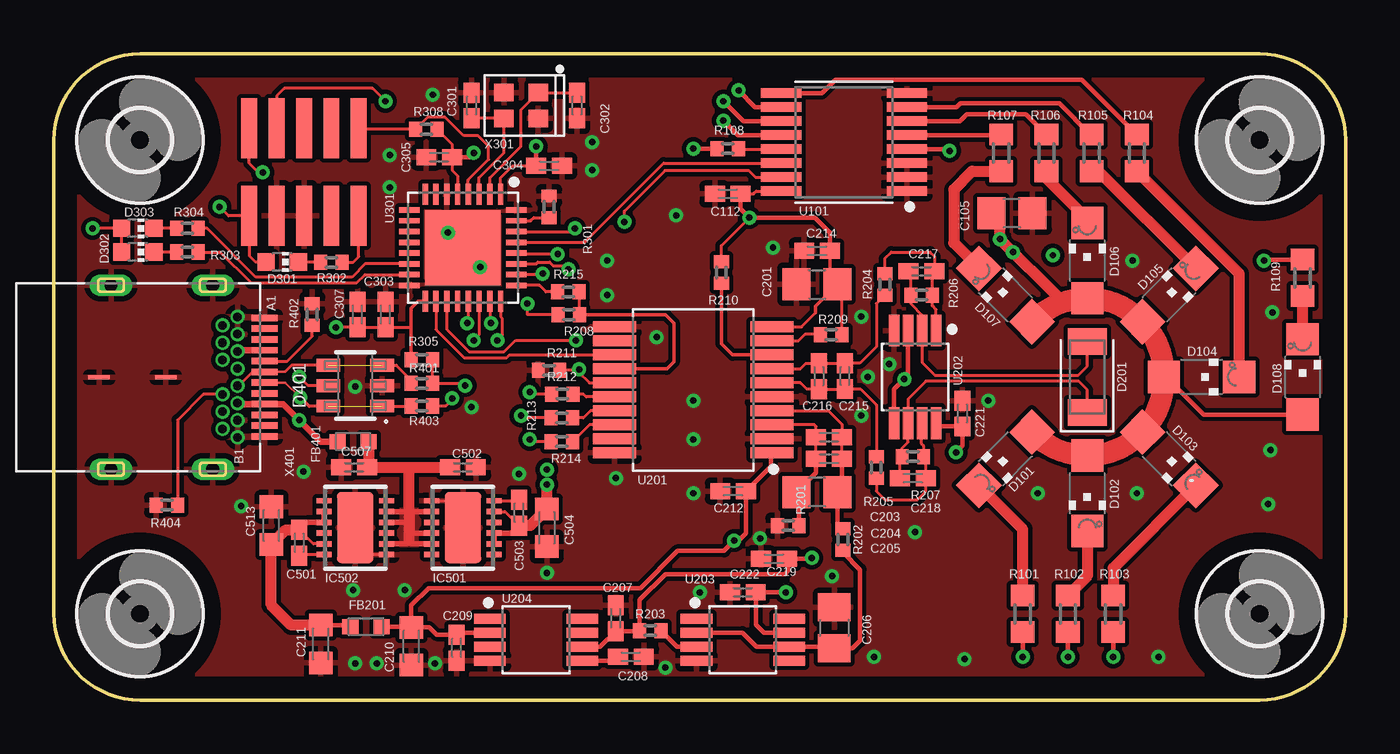
[diagram p6: board, top side]
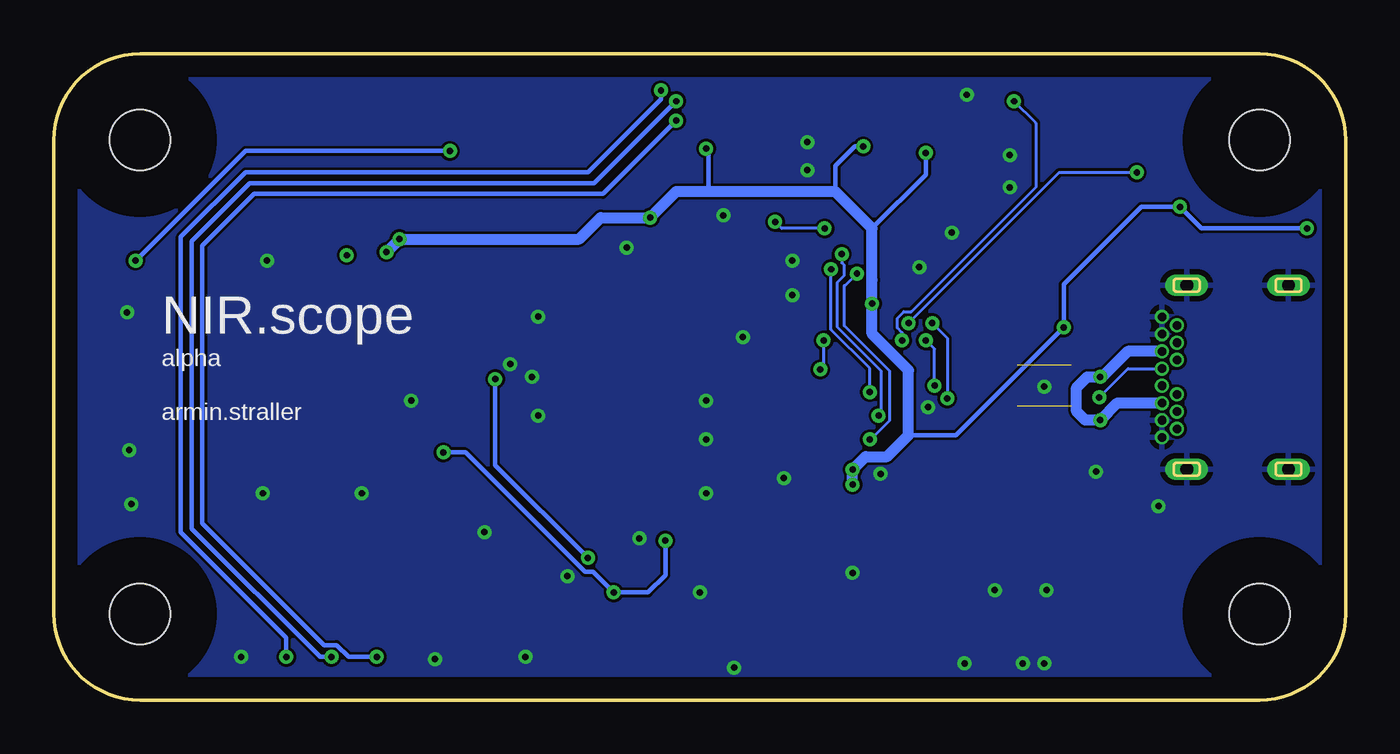
[diagram p7: board, bottom side, seen from below]

Size 60 x 30 mm. Coordinates in mm from the lower left corner, seen from the top.
Outline: 0,4 0,26 arc-90 4,30 56,30 arc-90 60,26 60,4 arc-90 56,0 4,0 arc-90 0,4
Copper layers (1*16): Top 0.035mm / dielectric 1.5mm / Bottom 0.035mm
Design rules "default *": minimum track width 5mil, minimum drill 0.3mm, track to track 5mil, track to pad 5mil, pad to pad 5mil, via to via 5mil, smd to smd 3mil, copper to edge 40mil, drill to drill 6mil, minimum pad ring 3mil, minimum via ring 3mil, stop-mask expansion 4mil, vias tented up to drill 13mil, thermal gap 10mil

### Footprints (pad centres in the part's own frame; a part is rotated, then mirrored left to right if it is on the bottom)
C0805 = smd 1.3 x 1.5: 1 -0.95,0; 2 0.95,0
C0402K = smd 0.925 x 0.74: 1 -0.6,0; 2 0.6,0
C0603K = smd 1.05 x 1.08: 1 -0.875,0; 2 0.875,0
CHIPLED_1206 = smd 1.5 x 1.5: A 0,-1.75; C 0,1.75
LEDC3316X110 = smd 1.229 x 1.812: 1 -1.65,0; 2 1.65,0
CHIP-LED0603 = smd 0.8 x 0.8: A 0,-0.75; C 0,0.75
WE-TVS_SOT23-6L = smd 0.6 x 1.1: 1 -0.95,-1.25; 2 0,-1.25; 3 0.95,-1.25; 4 0.95,1.25; 5 0,1.25; 6 -0.95,1.25
WE-CBF_0603(W=2.2) = smd 0.75 x 0.7: 1 -0.725,0; 2 0.725,0
2,8 = hole 2.8: 0,0
DFN12 = smd 0.25 x 0.7: 1 -1.25,-1.45; 2 -0.75,-1.45; 3 -0.25,-1.45; 4 0.25,-1.45; 5 0.75,-1.45; 6 1.25,-1.45; 7 1.25,1.45; 8 0.75,1.45; 9 0.25,1.45; 10 -0.25,1.45; 11 -0.75,1.45; 12 -1.25,1.45 | smd 3.3 x 1.7: EXP 0,0
R0603 = smd 1 x 1.1: 1 -0.85,0; 2 0.85,0
R0402 = smd 0.6 x 0.7: 1 -0.5,0; 2 0.5,0
SOP65P640X120-16 = smd 1.872 x 0.447: 1 -2.922,2.275; 2 -2.922,1.625; 3 -2.922,0.975; 4 -2.922,0.325; 5 -2.922,-0.325; 6 -2.922,-0.975; 7 -2.922,-1.625; 8 -2.922,-2.275; 9 2.922,-2.275; 10 2.922,-1.625; 11 2.922,-0.975; 12 2.922,-0.325; 13 2.922,0.325; 14 2.922,0.975; 15 2.922,1.625; 16 2.922,2.275
SOP65P780X200-20 = smd 2.002 x 0.515: 1 -3.653,2.925; 2 -3.653,2.275; 3 -3.653,1.625; 4 -3.653,0.975; 5 -3.653,0.325; 6 -3.653,-0.325; 7 -3.653,-0.975; 8 -3.653,-1.625; 9 -3.653,-2.275; 10 -3.653,-2.925; 11 3.653,-2.925; 12 3.653,-2.275; 13 3.653,-1.625; 14 3.653,-0.975; 15 3.653,-0.325; 16 3.653,0.325; 17 3.653,0.975; 18 3.653,1.625; 19 3.653,2.275; 20 3.653,2.925
SOP65P490X110-8 = smd 1.471 x 0.481: 1 -2.15,0.975; 2 -2.15,0.325; 3 -2.15,-0.325; 4 -2.15,-0.975; 5 2.15,-0.975; 6 2.15,-0.325; 7 2.15,0.325; 8 2.15,0.975
QFN50P500X500X60-33T350 = smd 0.96 x 0.25: 1 -2.485,1.75; 2 -2.485,1.25; 3 -2.485,0.75; 4 -2.485,0.25; 5 -2.485,-0.25; 6 -2.485,-0.75; 7 -2.485,-1.25; 8 -2.485,-1.75; 17 2.485,-1.75; 18 2.485,-1.25; 19 2.485,-0.75; 20 2.485,-0.25; 21 2.485,0.25; 22 2.485,0.75; 23 2.485,1.25; 24 2.485,1.75 | smd 0.25 x 0.96: 9 -1.75,-2.485; 10 -1.25,-2.485; 11 -0.75,-2.485; 12 -0.25,-2.485; 13 0.25,-2.485; 14 0.75,-2.485; 15 1.25,-2.485; 16 1.75,-2.485; 25 1.75,2.485; 26 1.25,2.485; 27 0.75,2.485; 28 0.25,2.485; 29 -0.25,2.485; 30 -0.75,2.485; 31 -1.25,2.485; 32 -1.75,2.485 | smd 3.5 x 3.5: 33 0,0
2.6X2.1-4-PAD = smd 0.9 x 0.8: 1 -0.8,-0.6; 2 0.8,-0.6; 3 0.8,0.6; 4 -0.8,0.6
CORTEX-M-CON-10P = smd 0.737 x 2.794: P$1 0,0; P$2 0,4.064; P$3 1.27,0; P$4 1.27,4.064; P$5 2.54,0; P$6 2.54,4.064; P$7 3.81,0; P$8 3.81,4.064; P$9 5.08,0; P$10 5.08,4.064
USBC_HORZONTAL_WE = smd 0.3 x 1.2: A1 2.262,11.785; A2 2.762,11.785; A3 3.262,11.785; A4 3.762,11.785; A5 4.262,11.785; A6 4.762,11.785; A7 5.262,11.785; A8 5.762,11.785; A9 6.262,11.785; A10 6.762,11.785; A11 7.262,11.785; A12 7.762,11.785 | drill 0.4 pad 0.65: B1 7.812,10.535; B2 7.412,9.835; B3 6.612,9.835; B4 6.212,10.535; B5 5.812,9.835; B6 5.412,10.535; B7 4.612,10.535; B8 4.212,9.835; B9 3.812,10.535; B10 3.412,9.835; B11 2.612,9.835; B12 2.212,10.535; GND 7.012,10.535; GND1 3.012,10.535 | drill 0.6 pad 1 long: Z1 0.742,9.385; Z2 9.282,9.385; Z3 9.282,4.655; Z4 0.742,4.655 | smd 0.2 x 1: Z5 5.012,7.205; Z6 5.012,4.105

### Placement (x,y rotation side)
C105  22uF  [C0805]  44.5,22.6 180 top
C112  100nF  [C0402K]  31.3,23.5 180 top
C201  10uF  [C0805]  35.45,19.3 0 top
C203  100pF  [C0402K]  36,12.2 180 top
C204  100nF  [C0402K]  36,11.2 180 top
C205  22uF  [C0805]  35.45,9.65 180 top
C206  22uF  [C0805]  36.25,3.35 270 top
C207  1uF  [C0402K]  26.1,3.8 90 top
C208  1uF  [C0402K]  26.8,2 0 top
C209  1uF  [C0402K]  18.7,2.43 270 top
C210  15uF  [C0603K]  16.6,2.5 90 top
C211  15uF  [C0603K]  12.4,2.6 90 top
C212  100nF  [C0402K]  31.55,9.7 180 top
C214  100nF  [C0402K]  35.45,20.85 180 top
C215  47nF  [C0402K]  36.74,15.04 270 top
C216  100pF  [C0402K]  35.54,15.03 270 top
C217  51pF  [C0402K]  40.3,19.9 0 top
C218  51pF  [C0402K]  39.9,10.3 0 top
C219  100nF  [C0402K]  33.45,6.55 180 top
C221  100nF  [C0402K]  42.2,13.3 90 top
C222  100nF  [C0402K]  32,5 180 top
C301  10pF  [C0402K]  19.4,27.6 90 top
C302  10pF  [C0402K]  24.3,27.6 270 top
C303  100nF  [C0402K]  15.4,17.9 90 top
C304  100nF  [C0402K]  23,24.8 0 top
C305  100nF  [C0402K]  17.9,25.2 180 top
C307  1uF  [C0402K]  14.1,17.9 90 top
C501  10nF  [C0402K]  11.4,7.3 90 top
C502  1uF  [C0402K]  19,10.8 0 top
C503  10nF  [C0402K]  21.6,8.7 270 top
C504  10uF  [C0603K]  22.9,8 90 top
C507  1uF  [C0402K]  13.95,10.8 180 top
C513  10uF  [C0603K]  10.1,8.1 270 top
D101  1650nm  [CHIPLED_1206]  44.2,11.2 135 top
D102  1550nm  [CHIPLED_1206]  48,9.6 180 top
D103  1450nm  [CHIPLED_1206]  51.8,11.2 225 top
D104  1300nm  [CHIPLED_1206]  53.3,15 270 top
D105  1200nm  [CHIPLED_1206]  51.8,18.8 315 top
D106  940nm  [CHIPLED_1206]  48,20.4 0 top
D107  850nm  [CHIPLED_1206]  44.2,18.8 45 top
D108  white  [CHIPLED_1206]  58,15 0 top
D201  SD003-151-001SMD  [LEDC3316X110]  48,15 90 top
D301  green  [CHIP-LED0603]  10.61,20.34 270 top
D302  orange  [CHIP-LED0603]  3.9,20.8 270 top
D303  green  [CHIP-LED0603]  3.9,21.9 270 top
D401  5Vdc  [WE-TVS_SOT23-6L]  14,14.6 90 top
FB201  240Ohm@100MHz  [WE-CBF_0603(W=2.2)]  14.5,3.4 0 top
FB401  240Ohm@100MHz  [WE-CBF_0603(W=2.2)]  13.9,12 0 top
H1  4,4 0 top
H2  56,4 0 top
H3  4,26 0 top
H4  56,26 0 top
IC501  LT1763IDE-3.3  [DFN12]  19,8 90 top
IC502  LT1763IDE-5  [DFN12]  14,8 270 top
R101  43  [R0603]  45,4 90 top
R102  43  [R0603]  47.1,4 90 top
R103  43  [R0603]  49.2,4 90 top
R104  43  [R0603]  50.3,25.4 270 top
R105  43  [R0603]  48.2,25.4 270 top
R106  39  [R0603]  46.1,25.4 270 top
R107  36  [R0603]  44,25.4 270 top
R108  100k  [R0402]  31.3,25.6 0 top
R109  6.8  [R0603]  58,19.6 270 top
R201  49.9  [R0402]  34.1,8.1 0 top
R202  49.9  [R0402]  36.65,7.45 270 top
R203  10k  [R0402]  27.7,3.22 180 top
R204  301  [R0402]  38.6,19.3 90 top
R205  301  [R0402]  38.2,10.8 270 top
R206  240k  [R0402]  40.3,18.8 180 top
R207  240k  [R0402]  39.9,11.3 180 top
R208  100k  [R0402]  23.91,17.89 180 top
R209  100k  [R0402]  36.1,16.96 0 top
R210  100k  [R0402]  31,19.85 90 top
R211  100k  [R0402]  23,15.3 0 top
R212  100  [R0402]  23.61,14.2 0 top
R213  100  [R0402]  23.6,13.1 0 top
R214  100  [R0402]  23.59,12 0 top
R215  100  [R0402]  23.9,18.95 0 top
R301  10k  [R0402]  23,22.9 270 top
R302  1k  [R0402]  12.89,20.32 180 top
R303  1k  [R0402]  6.2,20.8 180 top
R304  1k  [R0402]  6.2,21.9 180 top
R305  1k5  [R0402]  17.1,15.8 0 top
R308  100k  [R0402]  17.3,26.5 180 top
R401  22R  [R0402]  17.1,14.7 180 top
R402  5k1  [R0402]  12,17.9 90 top
R403  22R  [R0402]  17.1,13.65 180 top
R404  5k1  [R0402]  5.25,9.05 180 top
U101  TLC59208FTSSOP-16  [SOP65P640X120-16]  36.7,25.9 180 top
U201  ADS1255TSSOP  [SOP65P780X200-20]  29.7,14.4 180 top
U202  OPA2376PDSO-8  [SOP65P490X110-8]  40,15 270 top
U203  OPA350PDSO-8  [SOP65P490X110-8]  32,2.8 0 top
U204  REF5025PDSO-8  [SOP65P490X110-8]  22.4,2.8 0 top
U301  STM32F302K8U6UFQFPN32  [QFN50P500X500X60-33T350]  19,21 270 top
X301  8MHz  [2.6X2.1-4-PAD]  21.7,27.6 180 top
X302  CORTEX-MDEBUG-10P  [CORTEX-M-CON-10P]  9.08,22.48 0 top
X401  632723300011THT  [USBC_HORZONTAL_WE]  -2,20 270 top

### Tracks (layer width: path | path; a pad name or v marks a point on that pad's centre or on a via)
+3V3  (via drill 0.3 pad 0.65)
  Top 0.127: D105.A 51.55,15.1 | D104.A 51.55,14.9 D103.A
  Top 0.15: D301.A 9.36,20.34 9.08,20.62 X302.P$1 8.12,22.48 v7.7,22.9 | R308.1 18.5,25.8 C305.1 18.5,24.6 18.75,24.35 U301.5 | U301.1 20.75,24.25 21.3,24.8 C304.1 | 16.6,17.3 C303.1 C307.1 v13.1,17.3 | D302.A D303.A v1.8,21.9 | C112.1 32.5,23.5 32.62,23.62 U101.16 | IC501.5 20.95,8.75 C503.2 | U201.10 34.73,17.32 35.38,17.98 | R208.2 22,17.89 v22,18.4 | R210.2 31,21.1 v32.3,22.4 | R209.2 36.6,19.1 C201.2 36.5,19.3
  Top 0.152: C214.1 36.05,19.65 C201.2 35.38,18.27 35.38,17.98 | R305.1 16.6,17.3 16.6,18.2 16.91,18.52 U301.17
  Top 0.2: D108.A 53.4,13.25 51.55,15.1 | C112.1 31.9,22.8 v32.3,22.4 35.35,22.4 36.05,21.7 C214.1 | C304.1 v22.4,25.7 | C305.1 19.3,25.2 v19.5,25.4 | R108.1 v29.7,25.6
  Top 0.25: IC501.2 IC501.3 21.25,7.75 C503.2
  Top 0.5: C503.2 22.12,8.1 C504.2 v22.9,10 | 51.55,15.1 D104.A | C105.2 43.95,22.2 v43.95,21.4 46.7,18.65 D106.A
  Top 1: 51.55,15.1 arc90 D106.A arc46 D107.A | 51.55,14.9 arc-90 D102.A arc-46 D101.A
  Bottom 0.2: v1.8,21.9 6.7,21.9 v7.7,22.9 9.5,22.9 13.1,19.3 v13.1,17.3 18.1,12.3 20.3,12.3 | v19.5,25.4 19.5,24.4 22,21.9 | v22.4,25.7 22.8,25.7 23.7,24.8 23.7,23.6 | 29.8,23.6 29.6,23.8 29.6,25.5 v29.7,25.6
  Bottom 0.5: v22.9,10 v22.9,10.7 22.3,11.3 21.3,11.3 20.3,12.3 20.3,15.3 22,17 v22,18.4 22,19.51 22,21.9 23.7,23.6 29.8,23.6 31.1,23.6 v32.3,22.4 34.6,22.4 35.6,21.4 v43.95,21.4 v44.55,20.8
+5V
  Top 0.15: IC502.5 12.05,7.25 C501.2
  Top 0.2: FB201.1 13.7,3.48 C211.2
  Top 0.25: IC502.2 IC502.3 11.75,8.25 C501.2
  Top 0.5: C501.2 10.78,7.9 C513.2 10.1,4.4 11.03,3.48 C211.2
ADC1:2V5REF  (via drill 0.3 pad 0.65)
  Top 0.2: U202.3 39.67,15.07 v39.5,14.9 39.02,14.43 U202.5 | U204.6 25.38,2.48 C207.1 27.18,3.2 R203.2 27.2,4.65 28.4,5.85 33.95,5.85 34.1,6 34.1,6.5 34.15,6.55 | C219.1 34.15,6.55 | 34.15,6.55 35.15,6.55 v35.2,6.6
  Bottom 0.2: v35.2,6.6 39.5,10.9 v39.5,14.9
ADC1:2V5REFBUF
  Top 0.15: C206.2 37.1,2.4
  Top 0.2: U203.2 31.98,3.12 32.62,2.48 U203.6 | U203.6 35.72,2.48 | 36.9,2.7 36.62,2.42 36.65,2.4 37.1,2.4 37.45,2.75 37.45,6.05 36.65,6.85 R202.2 | C206.2 36.17,2.48 U203.6
ADC1:5V0F  (via drill 0.3 pad 0.65)
  Top 0.2: U204.2 18.8,3.12 C209.1 17.77,3.03 17.43,3.38 C210.2 | C210.2 16.57,3.4 FB201.2 | U202.8 41.12,12.7 C221.1 42.2,11.8 v41.9,11.5 | C210.2 16.6,4.4 17.4,5.2 27.24,5.2 28.96,6.93 31.13,6.93 v31.6,7.4 31.8,7.4 32.15,7.75 C212.1 33.3,10.85 33.3,11.42 U201.1 | U203.7 32.98,3.12 32.6,3.5 C222.1 v34,5
  Bottom 0.2: v31.6,7.4 31.6,5.8 32.4,5 v34,5 34.95,5.95 35.33,5.95 40.88,11.5 v41.9,11.5
ADC1:ANODE
  Top 0.15: D201.2 48,15.5 47.58,15.08 40.92,15.08 40.33,15.68 U202.2 40.33,17.88 39.8,18.4 R206.2 39.8,19.8 C217.1
ADC1:CATHODE
  Top 0.15: D201.1 48,14.4 47.6,14.8 40.5,14.8 39.67,13.97 39.67,12.9 U202.6 39.67,11.97 39.4,11.7 R207.2 39.3,11.2 C218.1
ADC1:CSZ
  Top 0.15: R215.2 R208.1
  Top 0.152: R208.1 28.41,17.89 28.8,17.5 28.8,15.7 28.48,15.38 U201.14
ADC1:DIN
  Top 0.15: U201.17 24.93,13.43 24.6,13.1 R213.2
ADC1:DOUT
  Top 0.15: U201.16 24.73,14.07 24.6,14.2 R212.2
ADC1:N$3
  Top 0.15: C204.2 C203.2 35.4,12.7 35.33,12.78 U201.3
  Top 0.2: R201.2 34.6,9.55 C205.2 35.4,10.55 C204.2
ADC1:N$4
  Top 0.15: C204.1 36.6,11.25 C203.1 36.6,12.8 35.98,13.43 U201.4
  Top 0.2: 36.6,11.25 36.6,9.85 C205.1 36.4,8.2 R202.1
ADC1:N$5
  Top 0.2: R203.1 28.95,2.48 U203.3
ADC1:N$6
  Top 0.2: U204.5 26.02,1.82 C208.1
ADC1:N$7
  Top 0.15: U202.1 40.98,18.12 40.8,18.3 R206.1 40.8,19.8 C217.2 40.9,20.6 40.7,20.8 38.9,20.8 38.6,20.5 R204.2
ADC1:N$8
  Top 0.15: U202.7 40.3,12.82 40.3,11.9 40.4,11.8 R207.1 40.5,11.2 C218.2 40.5,9.7 40.1,9.3 38.6,9.3 38.2,9.7 R205.2
ADC1:N$9
  Top 0.15: U201.6 34.67,14.72 34.97,14.43 C216.2 C215.2 37.46,14.44 38.2,13.7 R205.1
ADC1:N$10
  Top 0.15: U201.7 34.67,15.38 34.93,15.63 C216.1 C215.1 37.44,15.64 38.2,16.4 38.2,18.4 R204.1
ADC1:N$11
  Top 0.15: U201.9 34.58,16.68 34.9,17 35.56,17 R209.1
ADC1:SCLK
  Top 0.15: U201.18 24.88,12.78 R214.2
ADC1:SYNCZ
  Top 0.152: U201.8 31.52,16.02 31,16.55 R210.1
D+  (via drill 0.3 pad 0.65)
  Top 0.15: v19.1,14.6 19.1,14.7 R401.1 R305.2 | U301.22 19.75,16.95 v19.5,16.7
  Bottom 0.15: v19.1,14.6 19.1,16.3 v19.5,16.7
D-  (via drill 0.3 pad 0.65)
  Top 0.15: v18.5,14 18.5,13.95 18.2,13.65 R403.1 | U301.21 19.25,17.55 v19.2,17.5
  Bottom 0.15: v19.2,17.5 18.5,16.8 v18.5,14
DRDYZ  (via drill 0.3 pad 0.65)
  Top 0.15: U301.19 18.25,17.2 19.28,16.17 20.92,16.17 21.45,16.7 v24.25,16.7 | R211.2 24.35,15.3 v24.4,15.35 24.4,15.2 24.88,14.72 U201.15
  Bottom 0.15: v24.25,16.7 24.25,15.5 v24.4,15.35
GND  (via drill 0.3 pad 0.65)
  Top 0.15: IC501.7 18.45,9.25 19,8.7 IC501.EXP | IC502.7 14.15,6.75 14.1,6.7 14,6.8 IC502.EXP
  other vias: 37.5,17.8 38.8,15.6 37.5,13.2 37.8,15 26.1,10.3 29.7,9.6 32.8,7.5 30,5 36.15,5.75 28.4,1.5 14,1.7 15,1.7 17.7,1.7 22.9,5.9 8.7,9 11.6,10.6 13.9,5.1 16.3,5.1 21.6,10.5 19.4,13.6 29.7,12.1 29.7,13.9 25.7,20.4 25.7,18.8 28.9,22.5 33.4,21 25,24.6 17.6,28.1 25,25.9 43.4,13.9 15.6,23.8 15.6,25.3 50.1,20.4 50.3,9.6 45.7,9.6 40,7.8 38.1,2 42.3,1.9 51.3,2 56.4,9.1 56.5,11.6 56.6,18 18.3,21.7 19.8,20.1 28,16.85 14,14.55
  pour Top (isolate 0.2, rank 2): 0,26 arc-90 4,30 56,30 arc-90 60,26 60,4 arc-90 56,0 4,0 arc-90 0,4
  pour Bottom: 0,26 arc-90 4,30 56,30 arc-90 60,26 60,4 arc-90 56,0 4,0 arc-90 0,4
GND1  (via drill 0.3 pad 0.65)
  other vias: 46.4,20.65
LED1:N$1  (via drill 0.3 pad 0.65)
  Top 0.2: R101.1 v45,2 | U101.12 31.77,26.23 v31.1,26.9
  Bottom 0.2: v31.1,26.9 34.5,23.5 50.7,23.5 53.1,21.1 53.1,8.2 47.45,2.55 46.87,2.55 46.32,2 v45,2
LED1:N$2  (via drill 0.3 pad 0.65)
  Top 0.2: R102.1 v47.1,2 | U101.11 32.02,26.88 v31.1,27.8
  Bottom 0.2: v31.1,27.8 34.9,24 50.9,24 53.6,21.3 53.6,7.96 47.64,2 v47.1,2
LED1:N$3  (via drill 0.3 pad 0.65)
  Top 0.2: R103.1 v49.2,2 | U101.10 32.58,27.52 v31.8,28.3
  Bottom 0.2: v49.2,2 49.2,2.9 54.1,7.8 54.1,21.5 51.1,24.5 35.2,24.5 31.8,27.9 v31.8,28.3
LED1:N$4
  Top 0.2: R104.1 47.75,28.8 36.3,28.8 35.67,28.18 U101.9
LED1:N$5
  Top 0.2: U101.7 41.92,27.52 42.1,27.7 46.7,27.7 48.15,26.25 R105.1
LED1:N$6
  Top 0.2: R106.1 45.15,27.2 42.4,27.2 42.08,26.88 U101.6
LED1:N$7
  Top 0.2: U101.5 43.98,26.23 R107.1
LED1:N$8  (via drill 0.3 pad 0.65)
  Top 0.2: R109.1 56.25,20.45 v56.2,20.4 | U101.4 41.52,25.57 v41.6,25.5
  Bottom 0.2: v56.2,20.4 51.1,25.5 v41.6,25.5
LED1:N$9
  Top 0.5: D108.C R109.2
LED1:N$10
  Top 0.5: D107.C 42.96,20.06 41.8,21.23 41.8,23.7 42.65,24.55 R107.2
LED1:N$11
  Top 0.5: R106.2 46.1,24.22 48,22.32 D106.C
LED1:N$12
  Top 0.5: R105.2 48.52,24.55 D105.C
LED1:N$13
  Top 0.5: D104.C 55.05,19.8 R104.2
LED1:N$14
  Top 0.5: D103.C 49.2,6.12 R103.2
LED1:N$15
  Top 0.5: D102.C 48,5.75 R102.2
LED1:N$16
  Top 0.5: R101.2 45,7.92 D101.C
LED1:NRST
  Top 0.15: R108.2 31.82,25.57 U101.13
MCO
  Top 0.15: U301.18 17.75,17.2 19.05,15.9 21.04,15.9 21.17,16.02 U201.13
MCU1:HSE_IN
  Top 0.15: U301.2 20.25,24.25 21.7,25.7 21.7,27.4 X301.1 C302.1
MCU1:HSE_OUT
  Top 0.15: U301.3 19.75,24.25 20.9,25.4 X301.3 C301.1
MCU1:N$1
  Top 0.15: U301.14 14.46,20.25 13.84,19.64 9.38,19.64 7.11,21.9 R304.1
MCU1:N$2
  Top 0.15: U301.31 22.15,22.25 22.3,22.4 R301.2
MCU1:N$3
  Top 0.15: R302.1 13.89,20.32 14.16,20.59 X302.P$9
MCU1:N$4
  Top 0.15: D301.C 12.37,20.34 R302.2
MCU1:N$5
  Top 0.15: R303.1 7.72,20.8 9.16,19.36 14.06,19.36 14.45,19.75 U301.15
MCU1:N$6
  Top 0.15: R304.2 D303.C
MCU1:N$7
  Top 0.15: R303.2 D302.C
MCU1:NRST
  Top 0.15: U301.4 19.25,24.15 20.2,25.1 20.2,25.7 19.7,26.2 19.04,26.2 18.18,27.05 17.35,27.05 R308.2 14.2,26.5 X302.P$10
MCU1:SWCLK  (via drill 0.3 pad 0.65)
  Top 0.15: U301.24 20.75,17.8 20.83,17.72 20.83,16.93 v20.6,16.7 | v15.4,27.8 14.8,28.4 10.7,28.4 10.35,28.05 X302.P$4
  Bottom 0.15: v20.6,16.7 20.6,17.05 20.83,17.28 20.83,17.72 20.52,18.03 20.17,18.03 14.4,23.8 14.4,26.8 v15.4,27.8
MCU1:SWDIO  (via drill 0.3 pad 0.65)
  Top 0.15: U301.23 20.25,17.55 v20.3,17.5 | v9.7,24.5 9.5,24.5 9.08,24.92 X302.P$2
  Bottom 0.15: v20.3,17.5 13.3,24.5 v9.7,24.5
MISO  (via drill 0.3 pad 0.65)
  Top 0.15: R212.1 22.2,14.2 v22.1,14.3 | U301.27 22.41,20.25 22.48,20.33 23.03,20.33 23.18,20.17 23.73,20.17 v23.9,20
  Bottom 0.15: v22.1,14.3 22.1,15.4 23.9,17.2 v23.9,20
MOSI  (via drill 0.3 pad 0.65)
  Top 0.15: R213.1 21.8,13.1 v21.7,13.2 | v23.4,20.7 21.54,20.7 U301.28
  Bottom 0.15: v21.7,13.2 21.57,13.33 21.57,15.27 23.6,17.3 23.6,19.4 23.3,19.7 23.3,20.2 23.4,20.3 v23.4,20.7
NSS
  Top 0.15: R215.1 22.85,18.95 22.55,19.25 U301.25
SCK  (via drill 0.3 pad 0.65)
  Top 0.15: R214.1 22.2,12 v22.1,12.1 | U301.26 22.65,19.75 v22.7,19.8
  Bottom 0.15: v22.1,12.1 22.05,12.1 21.17,12.98 21.17,15.27 23.28,17.37 23.28,19.24 23.26,19.24 v22.7,19.8
SCL
  Top 0.15: U301.29 24.65,21.25 28.32,24.93 U101.14
SDA  (via drill 0.3 pad 0.65)
  Top 0.15: U301.30 24.05,21.75 v24.2,21.9 | v26.5,22.2 26.5,22.7 28.38,24.57 32.28,24.57 32.58,24.27 U101.15
  Bottom 0.15: v24.2,21.9 26.2,21.9 v26.5,22.2
SUPPLY5:N$1
  Top 0.15: IC502.6 11.45,6.75 C501.1
SUPPLY5:N$2
  Top 0.15: IC501.6 21.55,9.25 C503.1
USB1:CC1
  Top 0.15: X401.A5 10.84,15.74 12,16.9 R402.1
USB1:CC2
  Top 0.15: X401.B5 6.94,14.19 5.75,13 R404.1
USB1:DN  (via drill 0.3 pad 0.65)  (1 unrouted)
  Top 0.127: v11.45,14.05 v11.44,14.05 10.75,14.74 X401.A7
  Top 0.15: D401.6 11.85,13.65 | D401.1 R403.2
  Top 0.152: 11.85,13.65 v11.45,14.05
  Bottom 0.15: v11.45,14.05 10.11,15.39 X401.B7
USB1:DP  (1 unrouted)
  Top 0.127: 10.75,15.25 10.74,15.24 9.86,15.24 X401.A6
  Top 0.15: 10.75,15.25 11.05,15.55 D401.4 | X401.B6 8.59,14.59 9.23,15.24 9.86,15.24 | D401.3 15.9,15.55 16.6,14.85
  Top 0.152: R401.2 16.6,14.85
USB1:VBUS  (via drill 0.3 pad 0.65)
  Top 0.15: v11.4,15 11.8,14.6 D401.5
  Top 0.3: FB401.1 12.4,12 10.66,13.74 X401.A9 8.59,13.74 X401.B4 | X401.A4 8.59,16.24 X401.B9
  Bottom 0.5: X401.B4 10.6,13.8 v11.4,13 12.1,13 12.5,13.4 12.5,14.5 12,15 v11.4,15 11.31,15 10.12,16.19 X401.B9
V+
  Top 0.15: 16.55,8.75 16.5,8.8
  Top 0.25: IC502.11 16.45,8.75 16.5,8.8 | IC501.8 16.55,8.75 | IC502.10 16.45,8.25 16.5,8.2 | IC501.10 16.55,7.75 16.5,7.7 | IC501.11 16.65,7.25 16.5,7.4 16.35,7.25 IC502.8
  Top 0.5: 16.5,10.8 C507.1 14.5,10.85 14.62,10.97 FB401.2 | 16.5,10.8 C502.1 | 16.5,10.8 16.5,8.8 16.5,8.2 16.5,7.7 16.5,7.4
  pour Top: 16,8.8 16.9,8.8 17,8.8 17,7.3 17,7.2 16,7.2

### Text on the board
bNames: NIR.scope | alpha | armin.straller
Document: Discrete NIR Spectrometer by Armin Straller / Licensed according to repository